# EAGLE design lippa (EAGLE 9.4.0)

## Sheet 1 of 4
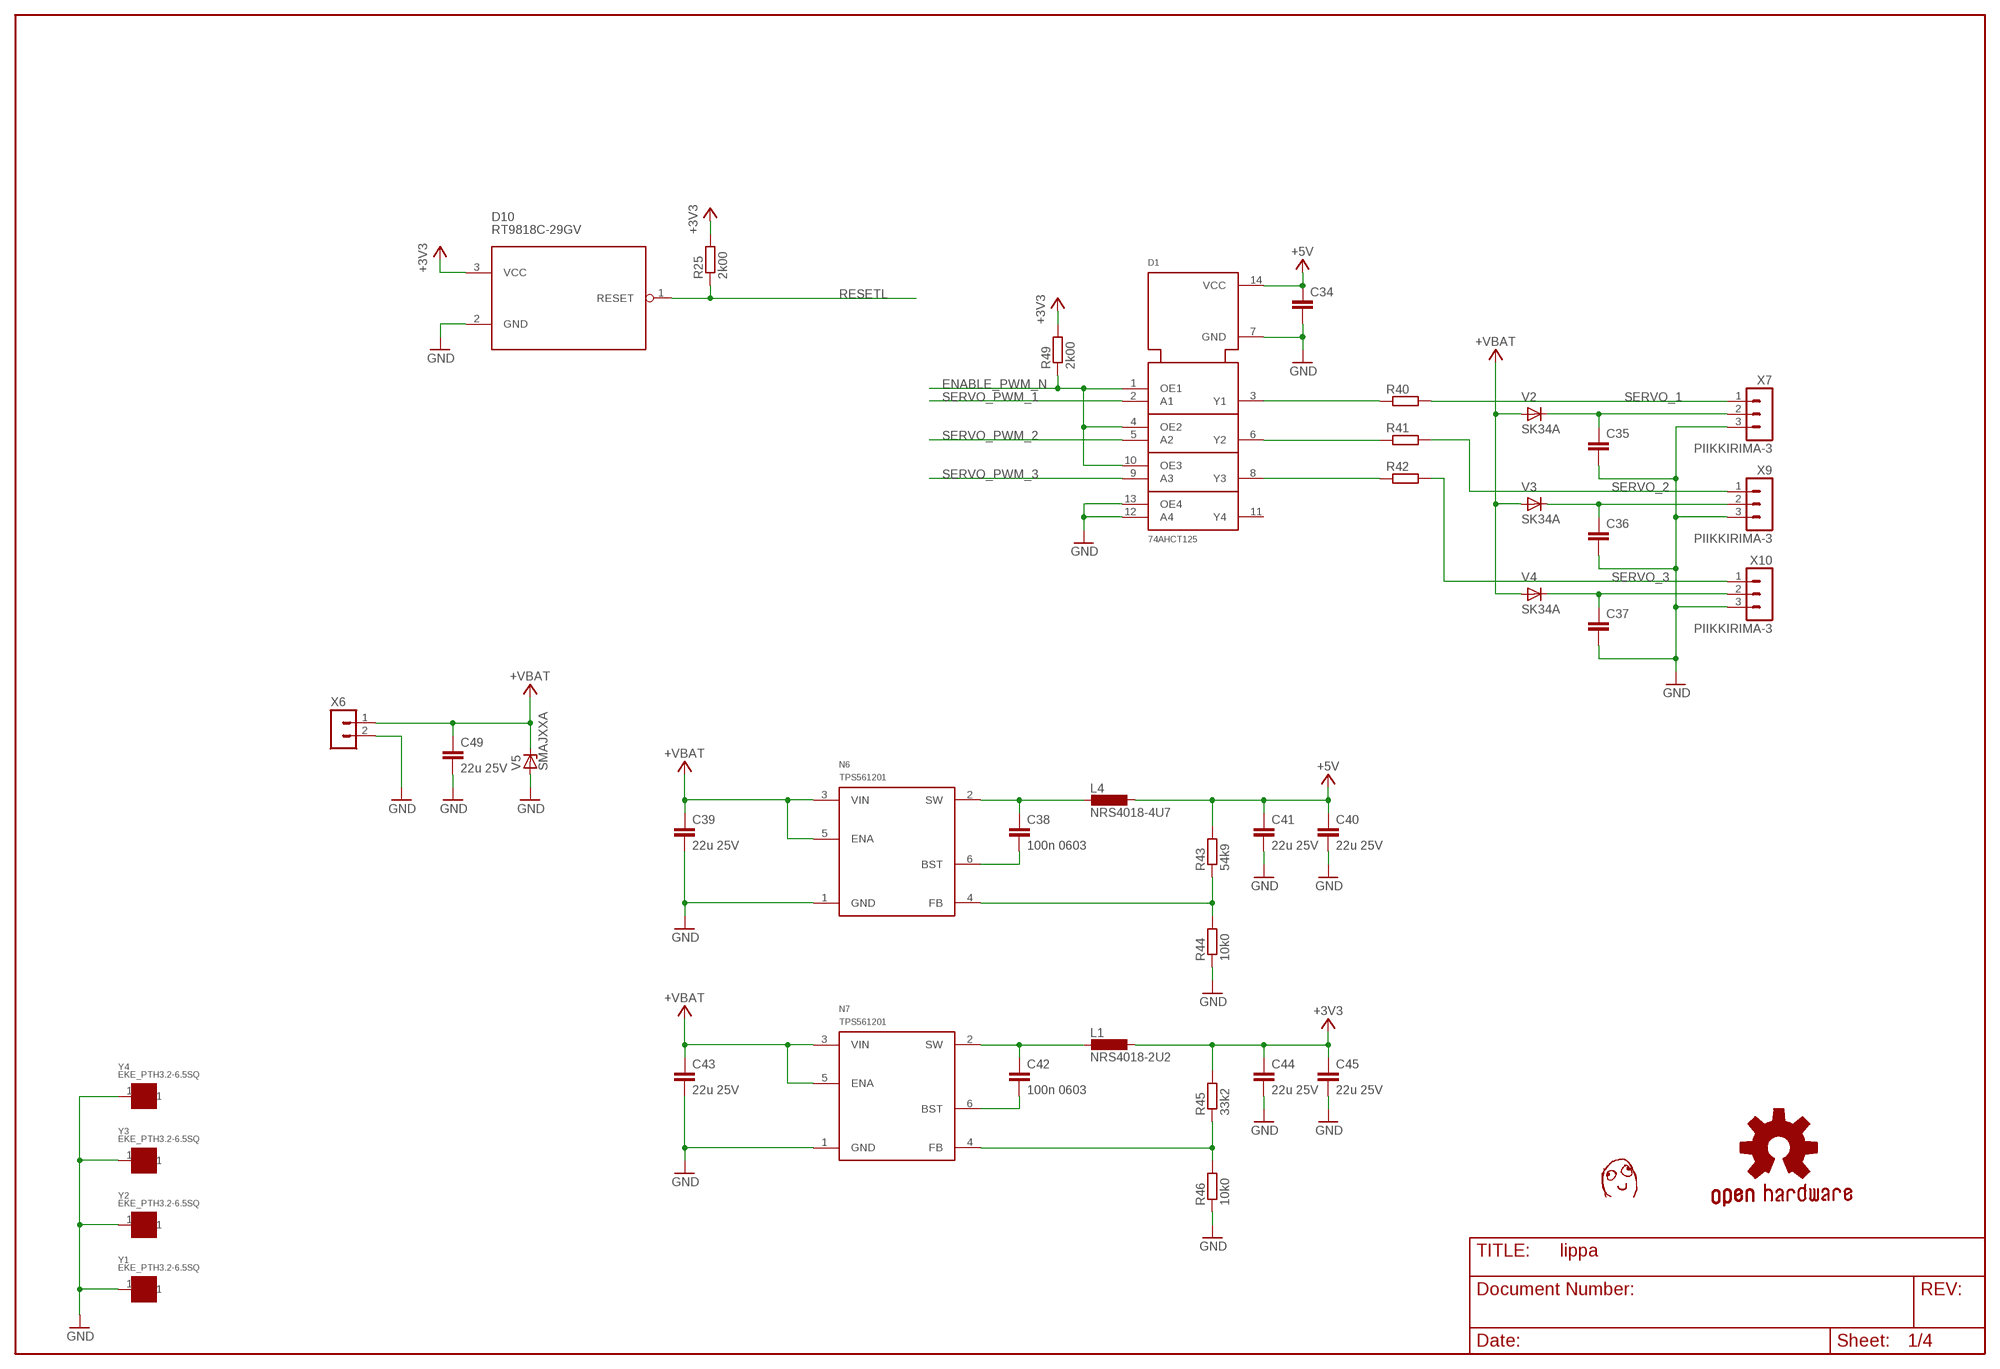
[diagram p0: schematic, sheet 1]

### Parts
C34  OMAT_IC_2_CAP0603  [OMAT_IC_2_C0603]
C35  OMAT_IC_2_CAP0603  [OMAT_IC_2_C0603]
C36  OMAT_IC_2_CAP0603  [OMAT_IC_2_C0603]
C37  OMAT_IC_2_CAP0603  [OMAT_IC_2_C0603]
C38  100n 0603  OMAT_IC_2_CAP0603  [OMAT_IC_2_C0603]
C39  22u 25V  OMAT_IC_2_CAP0805  [OMAT_IC_2_C0805]
C40  22u 25V  OMAT_IC_2_CAP0805  [OMAT_IC_2_C0805]
C41  22u 25V  OMAT_IC_2_CAP0805  [OMAT_IC_2_C0805]
C42  100n 0603  OMAT_IC_2_CAP0603  [OMAT_IC_2_C0603]
C43  22u 25V  OMAT_IC_2_CAP0805  [OMAT_IC_2_C0805]
C44  22u 25V  OMAT_IC_2_CAP0805  [OMAT_IC_2_C0805]
C45  22u 25V  OMAT_IC_2_CAP0805  [OMAT_IC_2_C0805]
C49  22u 25V  OMAT_IC_2_CAP0805  [OMAT_IC_2_C0805]
D1  74AHCT125  [SO14]
D10  RT9818C-29GV  [SOT23]
L1  NRS4018-2U2  [NRS4018]
L4  NRS4018-4U7  [NRS4018]
N6  TPS561201  [OMAT_IC_2_SOT23-6]
N7  TPS561201  [OMAT_IC_2_SOT23-6]
R25  2k00  RES0603  [R0603]
R40  OMAT_IC_2_RES0603  [OMAT_IC_2_R0603]
R41  OMAT_IC_2_RES0603  [OMAT_IC_2_R0603]
R42  OMAT_IC_2_RES0603  [OMAT_IC_2_R0603]
R43  54k9  OMAT_IC_2_RES0603  [OMAT_IC_2_R0603]
R44  10k0  OMAT_IC_2_RES0603  [OMAT_IC_2_R0603]
R45  33k2  OMAT_IC_2_RES0603  [OMAT_IC_2_R0603]
R46  10k0  OMAT_IC_2_RES0603  [OMAT_IC_2_R0603]
R49  2k00  RES0603  [R0603]
U$1  DAFUG  [DAFUG]
V2  SK34A  [OMAT_IC_2_DO214AC]
V3  SK34A  [OMAT_IC_2_DO214AC]
V4  SK34A  [OMAT_IC_2_DO214AC]
V5  SMAJXXA  [DO214AC]
X6  TE_RUUVILIITIN2  [TE_RUUVILIITIN2]
X7  PIIKKIRIMA-3  [PIIKKIRIMA-3]
X9  PIIKKIRIMA-3  [PIIKKIRIMA-3]
X10  PIIKKIRIMA-3  [PIIKKIRIMA-3]
Y1  EKE_PTH3.2-6.5SQ  [EKE_PTH-3.2-6.5SQ]
Y2  EKE_PTH3.2-6.5SQ  [EKE_PTH-3.2-6.5SQ]
Y3  EKE_PTH3.2-6.5SQ  [EKE_PTH-3.2-6.5SQ]
Y4  EKE_PTH3.2-6.5SQ  [EKE_PTH-3.2-6.5SQ]

### Nets
+3V3: C44.1 C45.1 D10.3(VCC) L1.1 R25.2 R45.2 R49.2 ; also sheet 2,3,4
+5V: C34.1 C40.1 C41.1 D1.14(VCC) L4.1 R43.2 ; also sheet 4
+VBAT [other]: C39.1 C43.1 C49.1 N6.3(VIN) N6.5(ENA) N7.3(VIN) N7.5(ENA) V2.A V3.A V4.A V5.C X6.1 ; also sheet 2,3
ENABLE_PWM_N: D1.1(OE1) D1.4(OE2) D1.10(OE3) R49.1 ; also sheet 4
GND: C34.2 C35.2 C36.2 C37.2 C39.2 C40.2 C41.2 C43.2 C44.2 C45.2 C49.2 D1.7(GND) D1.12(A4) D1.13(OE4) D10.2(GND) N6.1(GND) N7.1(GND) R44.1 R46.1 V5.A X6.2 X7.3 X9.3 X10.3 Y1.1 Y2.1 Y3.1 Y4.1 ; also sheet 2,3,4
N$28: D1.3(Y1) R40.1
N$29: D1.6(Y2) R41.1
N$30: D1.8(Y3) R42.1
N$43: C38.1 L4.2 N6.2(SW)
N$44: C37.1 V4.C X10.2
N$45: C36.1 V3.C X9.2
N$58: C35.1 V2.C X7.2
N$59: C38.2 N6.6(BST)
N$60: N6.4(FB) R43.1 R44.2
N$74: C42.1 L1.2 N7.2(SW)
N$75: C42.2 N7.6(BST)
N$76: N7.4(FB) R45.1 R46.2
RESETL: D10.1(RESET) R25.1 ; also sheet 3
SERVO_1: R40.2 X7.1
SERVO_2: R41.2 X9.1
SERVO_3: R42.2 X10.1
SERVO_PWM_1: D1.2(A1) ; also sheet 4
SERVO_PWM_2: D1.5(A2) ; also sheet 4
SERVO_PWM_3: D1.9(A3) ; also sheet 4
Unconnected: D1.11(Y4)

## Sheet 2 of 4
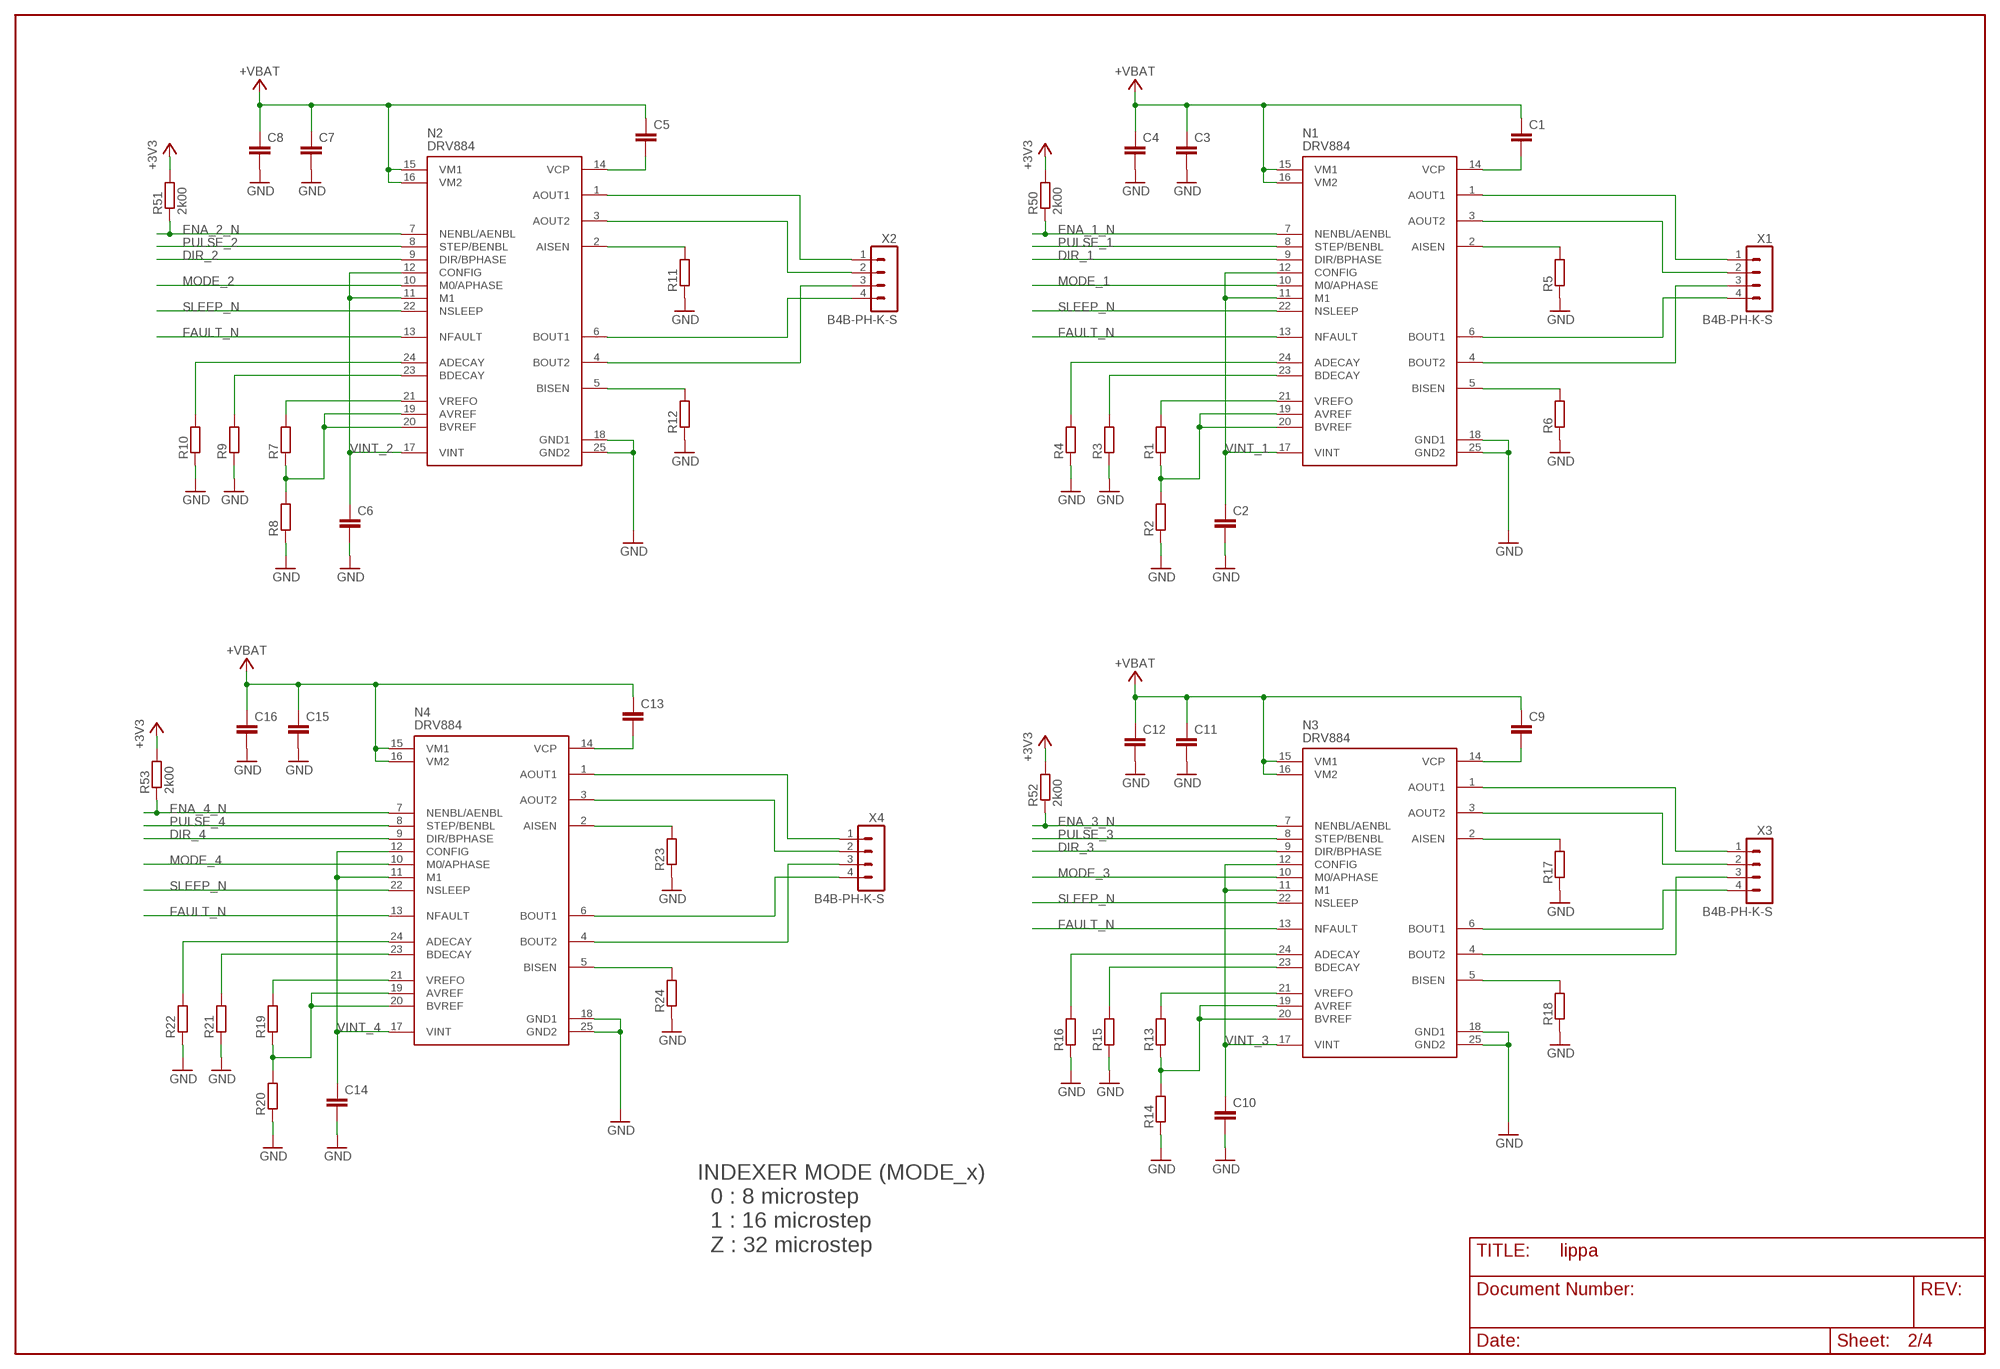
[diagram p1: schematic, sheet 2]

### Parts
C1  OMAT_IC_2_CAP0603  [OMAT_IC_2_C0603]
C2  OMAT_IC_2_CAP0603  [OMAT_IC_2_C0603]
C3  OMAT_IC_2_CAP0603  [OMAT_IC_2_C0603]
C4  OMAT_IC_2_CAP0805  [OMAT_IC_2_C0805]
C5  OMAT_IC_2_CAP0603  [OMAT_IC_2_C0603]
C6  OMAT_IC_2_CAP0603  [OMAT_IC_2_C0603]
C7  OMAT_IC_2_CAP0603  [OMAT_IC_2_C0603]
C8  OMAT_IC_2_CAP0805  [OMAT_IC_2_C0805]
C9  OMAT_IC_2_CAP0603  [OMAT_IC_2_C0603]
C10  OMAT_IC_2_CAP0603  [OMAT_IC_2_C0603]
C11  OMAT_IC_2_CAP0603  [OMAT_IC_2_C0603]
C12  OMAT_IC_2_CAP0805  [OMAT_IC_2_C0805]
C13  OMAT_IC_2_CAP0603  [OMAT_IC_2_C0603]
C14  OMAT_IC_2_CAP0603  [OMAT_IC_2_C0603]
C15  OMAT_IC_2_CAP0603  [OMAT_IC_2_C0603]
C16  OMAT_IC_2_CAP0805  [OMAT_IC_2_C0805]
N1  DRV884  [QFN50P400X400X100-25N]
N2  DRV884  [QFN50P400X400X100-25N]
N3  DRV884  [QFN50P400X400X100-25N]
N4  DRV884  [QFN50P400X400X100-25N]
R1  OMAT_IC_2_RES0603  [OMAT_IC_2_R0603]
R2  OMAT_IC_2_RES0603  [OMAT_IC_2_R0603]
R3  OMAT_IC_2_RES0603  [OMAT_IC_2_R0603]
R4  OMAT_IC_2_RES0603  [OMAT_IC_2_R0603]
R5  OMAT_IC_2_RES1206  [OMAT_IC_2_R1206]
R6  OMAT_IC_2_RES1206  [OMAT_IC_2_R1206]
R7  OMAT_IC_2_RES0603  [OMAT_IC_2_R0603]
R8  OMAT_IC_2_RES0603  [OMAT_IC_2_R0603]
R9  OMAT_IC_2_RES0603  [OMAT_IC_2_R0603]
R10  OMAT_IC_2_RES0603  [OMAT_IC_2_R0603]
R11  OMAT_IC_2_RES1206  [OMAT_IC_2_R1206]
R12  OMAT_IC_2_RES1206  [OMAT_IC_2_R1206]
R13  OMAT_IC_2_RES0603  [OMAT_IC_2_R0603]
R14  OMAT_IC_2_RES0603  [OMAT_IC_2_R0603]
R15  OMAT_IC_2_RES0603  [OMAT_IC_2_R0603]
R16  OMAT_IC_2_RES0603  [OMAT_IC_2_R0603]
R17  OMAT_IC_2_RES1206  [OMAT_IC_2_R1206]
R18  OMAT_IC_2_RES1206  [OMAT_IC_2_R1206]
R19  OMAT_IC_2_RES0603  [OMAT_IC_2_R0603]
R20  OMAT_IC_2_RES0603  [OMAT_IC_2_R0603]
R21  OMAT_IC_2_RES0603  [OMAT_IC_2_R0603]
R22  OMAT_IC_2_RES0603  [OMAT_IC_2_R0603]
R23  OMAT_IC_2_RES1206  [OMAT_IC_2_R1206]
R24  OMAT_IC_2_RES1206  [OMAT_IC_2_R1206]
R50  2k00  RES0603  [R0603]
R51  2k00  RES0603  [R0603]
R52  2k00  RES0603  [R0603]
R53  2k00  RES0603  [R0603]
X1  B4B-PH-K-S  [B4B-PH-K-S]
X2  B4B-PH-K-S  [B4B-PH-K-S]
X3  B4B-PH-K-S  [B4B-PH-K-S]
X4  B4B-PH-K-S  [B4B-PH-K-S]

### Nets
+3V3: R50.2 R51.2 R52.2 R53.2 ; also sheet 1,3,4
+VBAT [other]: C1.1 C3.1 C4.1 C5.1 C7.1 C8.1 C9.1 C11.1 C12.1 C13.1 C15.1 C16.1 N1.15(VM1) N1.16(VM2) N2.15(VM1) N2.16(VM2) N3.15(VM1) N3.16(VM2) N4.15(VM1) N4.16(VM2) ; also sheet 1,3
DIR_1: N1.9(DIR/BPHASE) ; also sheet 4
DIR_2: N2.9(DIR/BPHASE) ; also sheet 4
DIR_3: N3.9(DIR/BPHASE) ; also sheet 4
DIR_4: N4.9(DIR/BPHASE) ; also sheet 4
ENA_1_N: N1.7(NENBL/AENBL) R50.1 ; also sheet 4
ENA_2_N: N2.7(NENBL/AENBL) R51.1 ; also sheet 4
ENA_3_N: N3.7(NENBL/AENBL) R52.1 ; also sheet 4
ENA_4_N: N4.7(NENBL/AENBL) R53.1 ; also sheet 4
FAULT_N: N1.13(NFAULT) N2.13(NFAULT) N3.13(NFAULT) N4.13(NFAULT) ; also sheet 4
GND: C2.2 C3.2 C4.2 C6.2 C7.2 C8.2 C10.2 C11.2 C12.2 C14.2 C15.2 C16.2 N1.18(GND1) N1.25(GND2) N2.18(GND1) N2.25(GND2) N3.18(GND1) N3.25(GND2) N4.18(GND1) N4.25(GND2) R2.1 R3.1 R4.1 R5.1 R6.1 R8.1 R9.1 R10.1 R11.1 R12.1 R14.1 R15.1 R16.1 R17.1 R18.1 R20.1 R21.1 R22.1 R23.1 R24.1 ; also sheet 1,3,4
MODE_1: N1.10(M0/APHASE) ; also sheet 4
MODE_2: N2.10(M0/APHASE) ; also sheet 4
MODE_3: N3.10(M0/APHASE) ; also sheet 4
MODE_4: N4.10(M0/APHASE) ; also sheet 4
N$1: C1.2 N1.14(VCP)
N$3: N1.24(ADECAY) R4.2
N$4: N1.21(VREFO) R1.2
N$5: N1.19(AVREF) N1.20(BVREF) R1.1 R2.2
N$6: N1.23(BDECAY) R3.2
N$7: N1.2(AISEN) R5.2
N$8: N1.5(BISEN) R6.2
N$9: N1.6(BOUT1) X1.4
N$10: N1.4(BOUT2) X1.3
N$11: N1.1(AOUT1) X1.1
N$12: N1.3(AOUT2) X1.2
N$13: C5.2 N2.14(VCP)
N$18: N2.21(VREFO) R7.2
N$19: N2.19(AVREF) N2.20(BVREF) R7.1 R8.2
N$20: N2.24(ADECAY) R10.2
N$21: N2.23(BDECAY) R9.2
N$22: N2.2(AISEN) R11.2
N$23: N2.5(BISEN) R12.2
N$24: N2.6(BOUT1) X2.4
N$25: N2.4(BOUT2) X2.3
N$26: N2.1(AOUT1) X2.1
N$27: N2.3(AOUT2) X2.2
N$31: C9.2 N3.14(VCP)
N$33: N3.21(VREFO) R13.2
N$34: N3.19(AVREF) N3.20(BVREF) R13.1 R14.2
N$35: N3.24(ADECAY) R16.2
N$36: N3.23(BDECAY) R15.2
N$37: N3.2(AISEN) R17.2
N$38: N3.5(BISEN) R18.2
N$39: N3.6(BOUT1) X3.4
N$40: N3.4(BOUT2) X3.3
N$41: N3.1(AOUT1) X3.1
N$42: N3.3(AOUT2) X3.2
N$46: C13.2 N4.14(VCP)
N$48: N4.21(VREFO) R19.2
N$49: N4.19(AVREF) N4.20(BVREF) R19.1 R20.2
N$50: N4.24(ADECAY) R22.2
N$51: N4.23(BDECAY) R21.2
N$52: N4.2(AISEN) R23.2
N$53: N4.5(BISEN) R24.2
N$54: N4.6(BOUT1) X4.4
N$55: N4.4(BOUT2) X4.3
N$56: N4.1(AOUT1) X4.1
N$57: N4.3(AOUT2) X4.2
PULSE_1: N1.8(STEP/BENBL) ; also sheet 4
PULSE_2: N2.8(STEP/BENBL) ; also sheet 4
PULSE_3: N3.8(STEP/BENBL) ; also sheet 4
PULSE_4: N4.8(STEP/BENBL) ; also sheet 4
SLEEP_N: N1.22(NSLEEP) N2.22(NSLEEP) N3.22(NSLEEP) N4.22(NSLEEP) ; also sheet 4
VINT_1: C2.1 N1.11(M1) N1.12(CONFIG) N1.17(VINT)
VINT_2: C6.1 N2.11(M1) N2.12(CONFIG) N2.17(VINT)
VINT_3: C10.1 N3.11(M1) N3.12(CONFIG) N3.17(VINT)
VINT_4: C14.1 N4.11(M1) N4.12(CONFIG) N4.17(VINT)

### Notes on the sheet
- INDEXER MODE (MODE_x)
    0 : 8 microstep
    1 : 16 microstep
    Z : 32 microstep

## Sheet 3 of 4
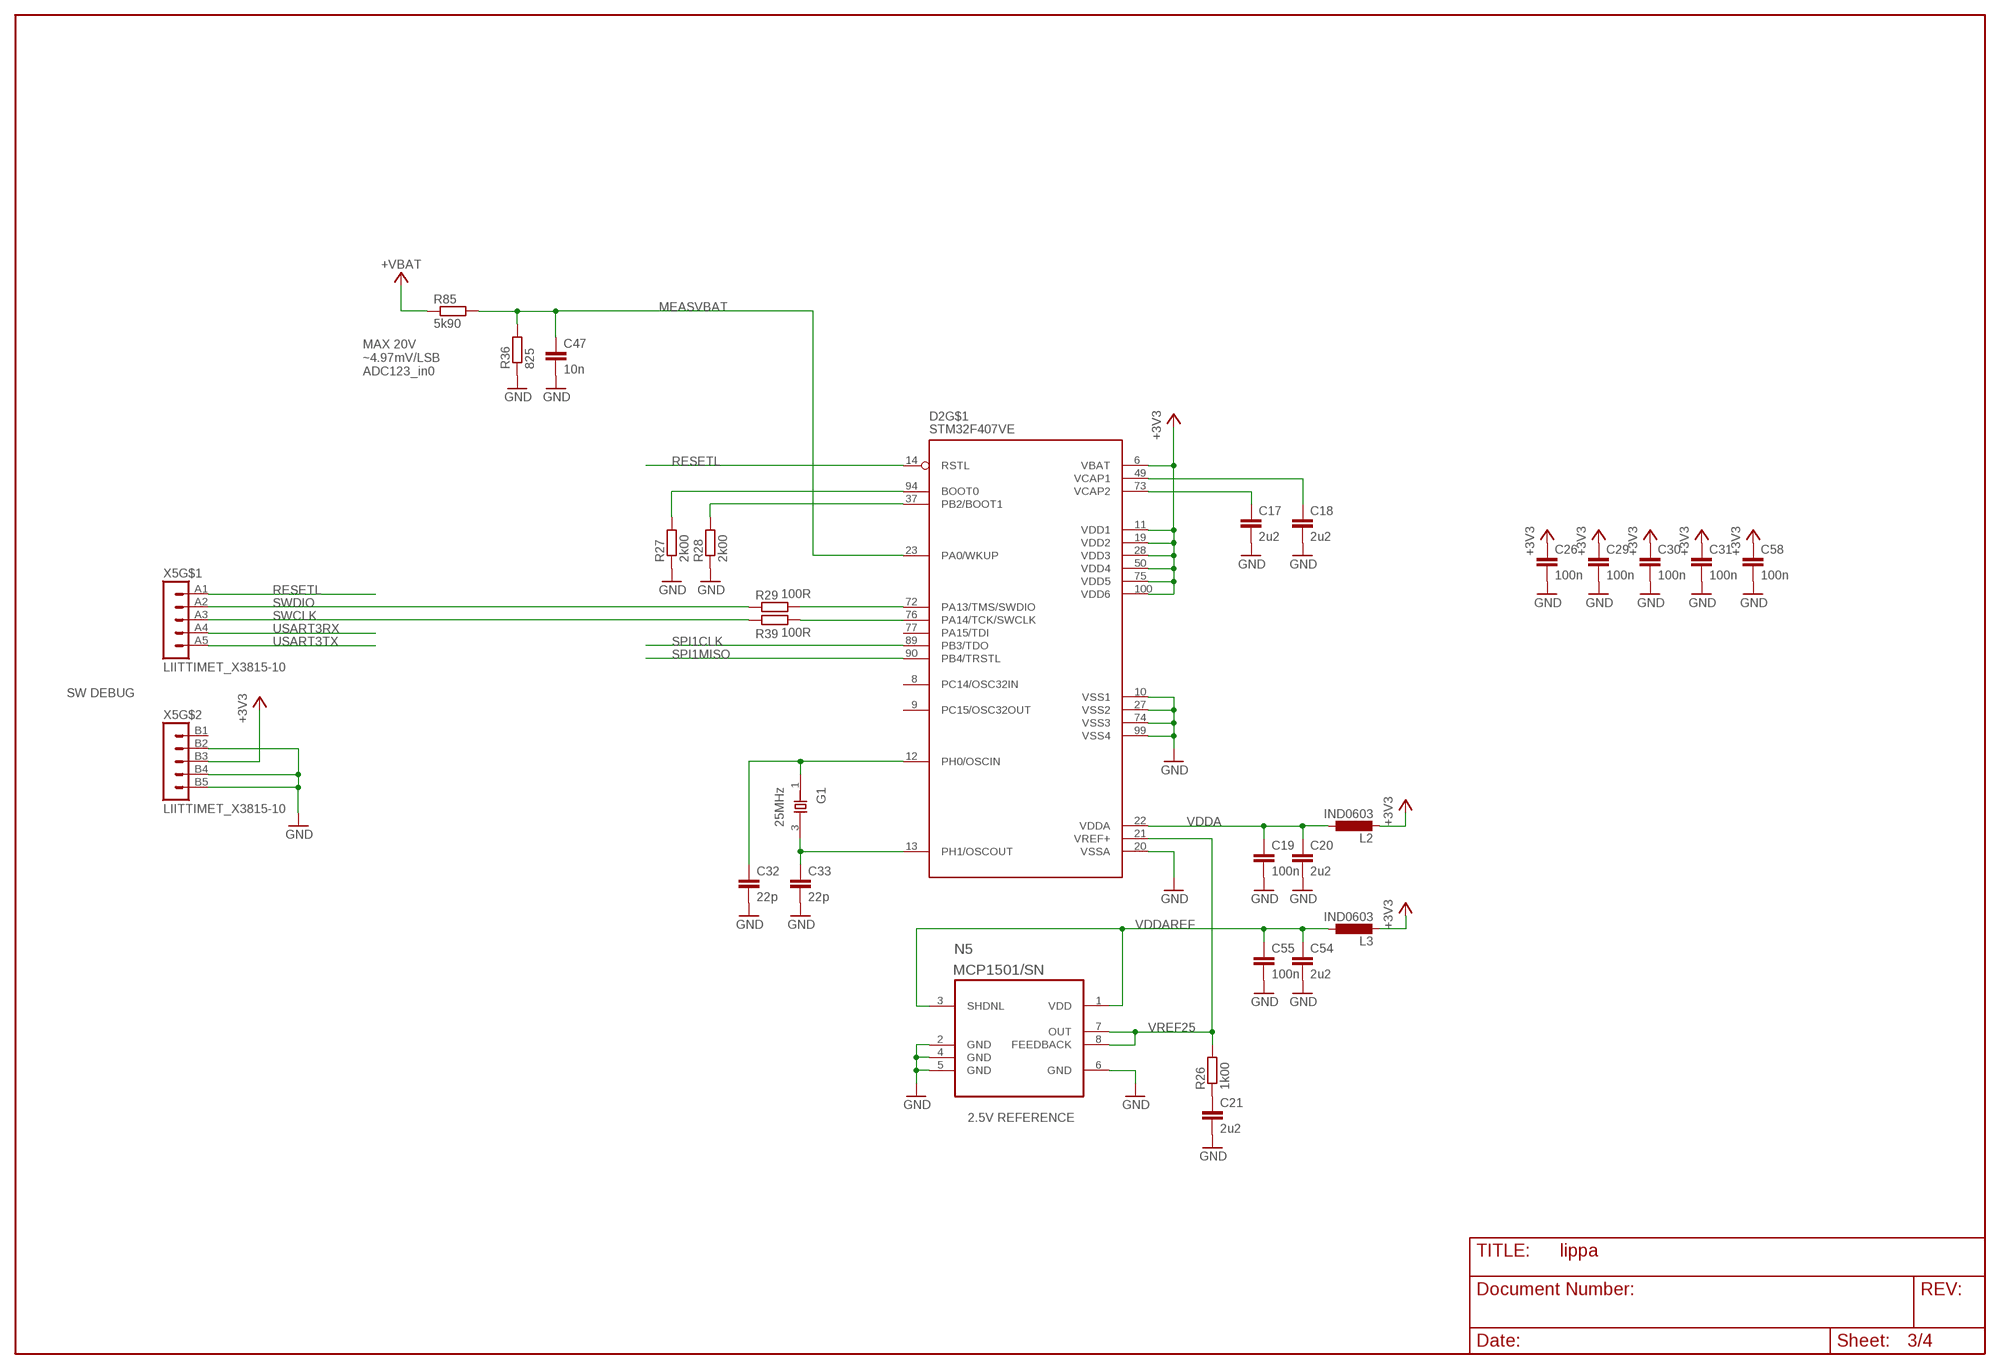
[diagram p2: schematic, sheet 3]

### Parts
C17  2u2  CAP0603  [C0603]
C18  2u2  CAP0603  [C0603]
C19  100n  CAP0603  [C0603]
C20  2u2  CAP0603  [C0603]
C21  2u2  CAP0603  [C0603]
C26  100n  CAP0603  [C0603]
C29  100n  CAP0603  [C0603]
C30  100n  CAP0603  [C0603]
C31  100n  CAP0603  [C0603]
C32  22p  CAP0603  [C0603]
C33  22p  CAP0603  [C0603]
C47  10n  CAP0603  [C0603]
C54  2u2  CAP0603  [C0603]
C55  100n  CAP0603  [C0603]
C58  100n  CAP0603  [C0603]
D2  STM32F407VE  [LQFP-100]
G1  25MHz  XTAL_3225_SMD  [X_3225]
L2  IND0603  [R0603]
L3  IND0603  [R0603]
N5  MCP1501/SN  [SOIC8-N_MC]
R26  1k00  RES0603  [R0603]
R27  2k00  RES0603  [R0603]
R28  2k00  RES0603  [R0603]
R29  100R  PASSIIVIT_RES0603  [PASSIIVIT_R0603]
R36  825  RES0603  [R0603]
R39  100R  PASSIIVIT_RES0603  [PASSIIVIT_R0603]
R85  5k90  RES0603  [R0603]
X5  LIITTIMET_X3815-10  [LIITTIMET_15110102601]

### Nets
+3V3: C26.1 C29.1 C30.1 C31.1 C58.1 D2.6(VBAT) D2.11(VDD1) D2.19(VDD2) D2.28(VDD3) D2.50(VDD4) D2.75(VDD5) D2.100(VDD6) L2.2 L3.2 X5.B3 ; also sheet 1,2,4
+VBAT [other]: R85.1 ; also sheet 1,2
BOOT0: D2.94(BOOT0) R27.2
BOOT1: D2.37(PB2/BOOT1) R28.2
GND: C17.2 C18.2 C19.2 C20.2 C21.2 C26.2 C29.2 C30.2 C31.2 C32.2 C33.2 C47.2 C54.2 C55.2 C58.2 D2.10(VSS1) D2.20(VSSA) D2.27(VSS2) D2.74(VSS3) D2.99(VSS4) N5.2(GND) N5.4(GND) N5.5(GND) N5.6(GND) R27.1 R28.1 R36.1 X5.B2 X5.B4 X5.B5 ; also sheet 1,2,4
MEASVBAT: C47.1 D2.23(PA0/WKUP) R36.2 R85.2
N$61: C21.1 R26.1
OSCIN: C32.1 D2.12(PH0/OSCIN) G1.1(X1)
OSCOUT: C33.1 D2.13(PH1/OSCOUT) G1.3(X2)
RESETL: D2.14(RSTL) X5.A1 ; also sheet 1
SPI1CLK: D2.89(PB3/TDO) ; also sheet 4
SPI1MISO: D2.90(PB4/TRSTL) ; also sheet 4
SWCLK: R39.1 X5.A3
SWCLK_CPU: D2.76(PA14/TCK/SWCLK) R39.2
SWDIO: R29.1 X5.A2
SWDIO_CPU: D2.72(PA13/TMS/SWDIO) R29.2
USART3RX: X5.A4 ; also sheet 4
USART3TX: X5.A5 ; also sheet 4
VCAP1: C18.1 D2.49(VCAP1)
VCAP2: C17.1 D2.73(VCAP2)
VDDA: C19.1 C20.1 D2.22(VDDA) L2.1
VDDAREF: C54.1 C55.1 L3.1 N5.1(VDD) N5.3(SHDNL)
VREF25: D2.21(VREF+) N5.7(OUT) N5.8(FEEDBACK) R26.2
Unconnected: D2.8(PC14/OSC32IN) D2.9(PC15/OSC32OUT) D2.77(PA15/TDI) X5.B1

### Notes on the sheet
- MAX 20V
  ~4.97mV/LSB
  ADC123_in0
- SW DEBUG
- 2.5V REFERENCE

## Sheet 4 of 4
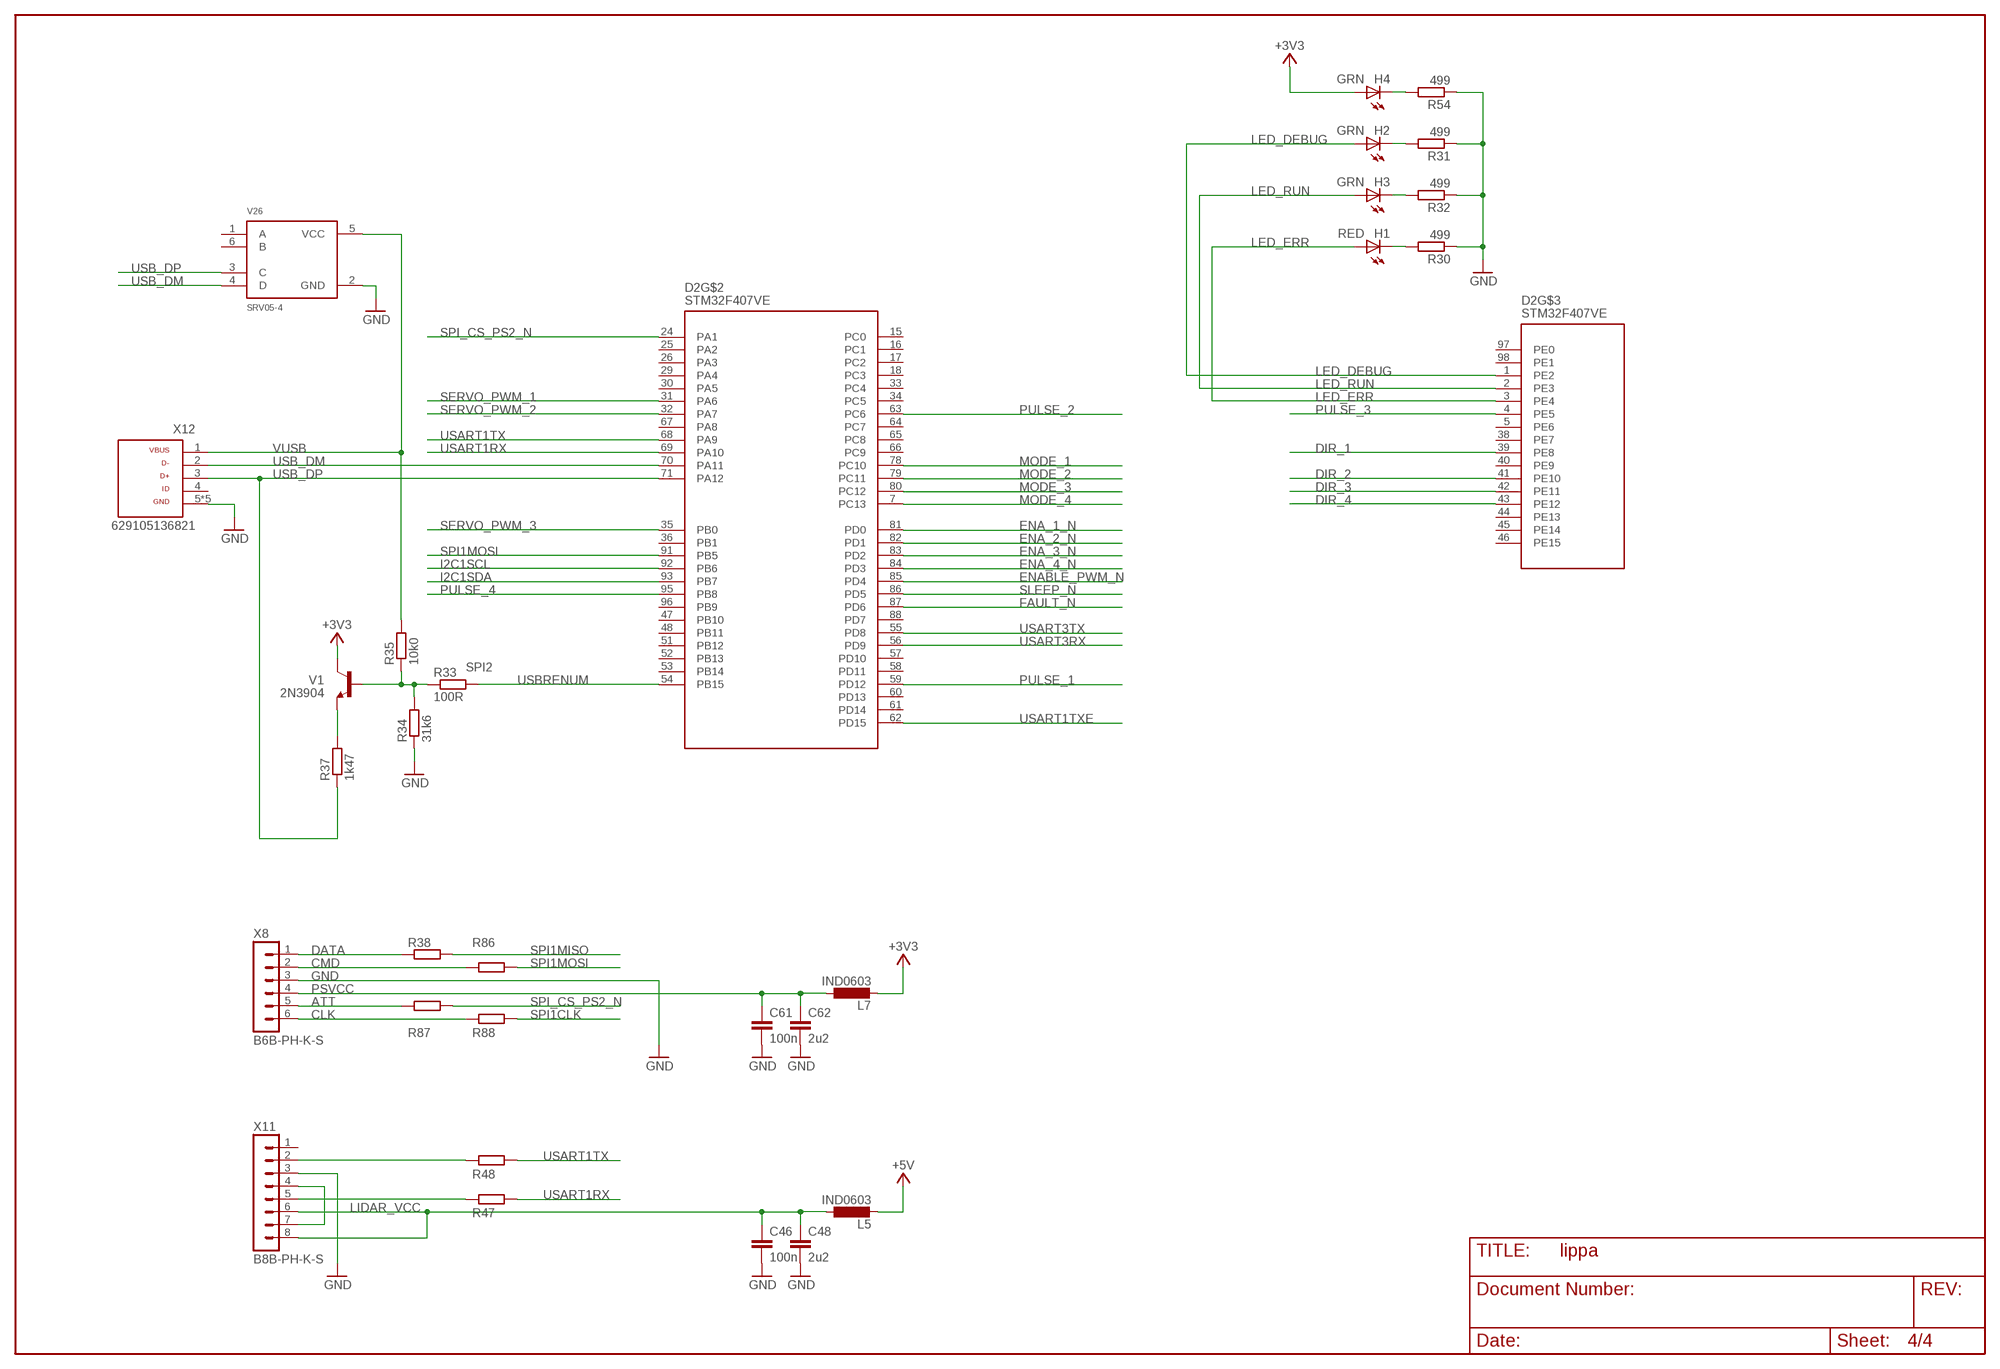
[diagram p3: schematic, sheet 4]

### Parts
C46  100n  CAP0603  [C0603]
C48  2u2  CAP0603  [C0603]
C61  100n  CAP0603  [C0603]
C62  2u2  CAP0603  [C0603]
H1  RED  LEDCHIP-LED0603  [CHIP-LED0603]
H2  GRN  LEDCHIP-LED0603  [CHIP-LED0603]
H3  GRN  LEDCHIP-LED0603  [CHIP-LED0603]
H4  GRN  LEDCHIP-LED0603  [CHIP-LED0603]
L5  IND0603  [R0603]
L7  IND0603  [R0603]
R30  499  RES0603  [R0603]
R31  499  RES0603  [R0603]
R32  499  RES0603  [R0603]
R33  100R  PASSIIVIT_RES0603  [PASSIIVIT_R0603]
R34  31k6  PASSIIVIT_RES0603  [PASSIIVIT_R0603]
R35  10k0  PASSIIVIT_RES0603  [PASSIIVIT_R0603]
R37  1k47  PASSIIVIT_RES0603  [PASSIIVIT_R0603]
R38  RES0603  [OMAT_IC_2_R0603]
R47  RES0603  [OMAT_IC_2_R0603]
R48  RES0603  [OMAT_IC_2_R0603]
R54  499  RES0603  [R0603]
R86  RES0603  [OMAT_IC_2_R0603]
R87  RES0603  [OMAT_IC_2_R0603]
R88  RES0603  [OMAT_IC_2_R0603]
V1  2N3904  [OMAT_IC_2_SOT23]
V26  SRV05-4  [OMAT_IC_2_SOT23-6]
X8  B6B-PH-K-S  [B6B-PH-K-S]
X11  B8B-PH-K-S  [B8B-PH-K-S]
X12  629105136821  [629105136821]

### Nets
+3V3: H4.A L7.2 V1.3(C) ; also sheet 1,2,3
+5V: L5.2 ; also sheet 1
ATT: R87.1 X8.5
CLK: R88.1 X8.6
CMD: R86.1 X8.2
DATA: R38.1 X8.1
DIR_1: D2.39(PE8) ; also sheet 2
DIR_2: D2.41(PE10) ; also sheet 2
DIR_3: D2.42(PE11) ; also sheet 2
DIR_4: D2.43(PE12) ; also sheet 2
ENA_1_N: D2.81(PD0) ; also sheet 2
ENA_2_N: D2.82(PD1) ; also sheet 2
ENA_3_N: D2.83(PD2) ; also sheet 2
ENA_4_N: D2.84(PD3) ; also sheet 2
ENABLE_PWM_N: D2.85(PD4) ; also sheet 1
FAULT_N: D2.87(PD6) ; also sheet 2
GND: C46.2 C48.2 C61.2 C62.2 R30.1 R31.1 R32.1 R34.1 R54.1 V26.2(GND) X8.3 X11.3 X12.5 X12.Z1 X12.Z2 X12.Z3 X12.Z4 ; also sheet 1,2,3
I2C1SCL: D2.92(PB6)
I2C1SDA: D2.93(PB7)
LED_DEBUG: D2.1(PE2) H2.A
LED_ERR: D2.3(PE4) H1.A
LED_RUN: D2.2(PE3) H3.A
LIDAR_VCC: C46.1 C48.1 L5.1 X11.6 X11.8
MODE_1: D2.78(PC10) ; also sheet 2
MODE_2: D2.79(PC11) ; also sheet 2
MODE_3: D2.80(PC12) ; also sheet 2
MODE_4: D2.7(PC13) ; also sheet 2
N$17: H4.C R54.2
N$64: H2.C R31.2
N$65: H1.C R30.2
N$66: H3.C R32.2
N$67: R33.1 R34.2 R35.1 V1.1(B)
N$68: R37.2 V1.2(E)
N$69: X11.4 X11.7
N$71: R48.1 X11.2
N$72: R47.1 X11.5
PSVCC: C61.1 C62.1 L7.1 X8.4
PULSE_1: D2.59(PD12) ; also sheet 2
PULSE_2: D2.63(PC6) ; also sheet 2
PULSE_3: D2.4(PE5) ; also sheet 2
PULSE_4: D2.95(PB8) ; also sheet 2
SERVO_PWM_1: D2.31(PA6) ; also sheet 1
SERVO_PWM_2: D2.32(PA7) ; also sheet 1
SERVO_PWM_3: D2.35(PB0) ; also sheet 1
SLEEP_N: D2.86(PD5) ; also sheet 2
SPI1CLK: R88.2 ; also sheet 3
SPI1MISO: R38.2 ; also sheet 3
SPI1MOSI: D2.91(PB5) R86.2
SPI_CS_PS2_N: D2.24(PA1) R87.2
USART1RX: D2.69(PA10) R47.2
USART1TX: D2.68(PA9) R48.2
USART1TXE: D2.62(PD15)
USART3RX: D2.56(PD9) ; also sheet 3
USART3TX: D2.55(PD8) ; also sheet 3
USB_DM [other]: D2.70(PA11) V26.4(D) X12.2
USB_DP [other]: D2.71(PA12) R37.1 V26.3(C) X12.3
USBRENUM: D2.54(PB15) R33.2
VUSB: R35.2 V26.5(VCC) X12.1
Unconnected: D2.5(PE6) D2.15(PC0) D2.16(PC1) D2.17(PC2) D2.18(PC3) D2.25(PA2) D2.26(PA3) D2.29(PA4) D2.30(PA5) D2.33(PC4) D2.34(PC5) D2.36(PB1) D2.38(PE7) D2.40(PE9) D2.44(PE13) D2.45(PE14) D2.46(PE15) D2.47(PB10) D2.48(PB11) D2.51(PB12) D2.52(PB13) D2.53(PB14) D2.57(PD10) D2.58(PD11) D2.60(PD13) D2.61(PD14) D2.64(PC7) D2.65(PC8) D2.66(PC9) D2.67(PA8) D2.88(PD7) D2.96(PB9) D2.97(PE0) D2.98(PE1) V26.1(A) V26.6(B) X11.1 X12.4

### Notes on the sheet
- SPI2

## Library data of the parts
C1-C16 C34-C45 C49 = lippa:OMAT_IC_2_CAP
C17-C21 C26 C29-C33 C46-C48 C54 C55 C58 C61 C62 = omat_ic_2:CAP
D1 = lippa:74AHCT125
D2 = lippa:STM32F407VE
D10 = omat_ic_2:RT9818C-29GV
G1 = omat_ic_2:XTAL_3225_SMD: CRYSTAL CLOCK OSCILLATORS 5.0 Vdc or 3.3 Vdc - LOW PROFILE ULTRA MINIATURE CERAMIC SURFACE MOUNT Source: http://www.abracon.com/Oscillators/asf1-L-L1.pdf
H1-H4 = omat_ic_2:LED: LED OSRAM: - CHIPLED LG R971, LG N971, LY N971, LG Q971, LY Q971, LO R971, LY R971 LH N974, LH R974 LS Q976, LO Q976, LY Q976 LO Q996 - Hyper CHIPLED LW Q18S LB Q993, LB Q99A, LB R99A - SideLED LS A670, LO A670, LY A670, LG A670, LP A670 LB A673, LV A673, LT A673, LW A673 LH A674 LY A675 LS A676, LA A676, LO A676, LY A676, LW A676 LS A679, LY A679, LG A679 - Hyper Micro SIDELED® LS Y876, LA Y876, LO Y876, LY Y876 LT Y87S - SmartLED LW L88C, LW L88S LB L89C, LB L89S, LG L890 LS L89K, LO L89K, LY L89K LS L896, LA L896, LO L896, LY L896 - TOPLED LS T670, LO T670, LY T670, LG T670, LP T670 LSG T670, LSP T670, LSY T670, LOP T670, LYG T670 LG T671, LOG T671, LSG T671 LB T673, LV T673, LT T673, LW T673 LH T674 LS T676, LA T676, LO T676, LY T676, LB T676, LH T676, LSB T676, LW T676 LB T67C, LV T67C, LT T67C, LS T67K, LO T67K, LY T67K, LW E67C LS E67B, LA E67B, LO E67B, LY E67B, LB E67C, LV E67C, LT E67C LW T67C LS T679, LY T679, LG T679 LS T770, LO T770, LY T770, LG T770, LP T770 LB T773, LV T773, LT T773, LW T773 LH T774 LS E675, LA E675, LY E675, LS T675 LS T776, LA T776, LO T776, LY T776, LB T776 LHGB T686 LT T68C, LB T68C - Hyper Mini TOPLED® LB M676 - Mini TOPLED Santana® LG M470 LS M47K, LO M47K, LY M47K Source: http://www.osram.convergy.de LUXEON: - LUMILED® LXK2-PW12-R00, LXK2-PW12-S00, LXK2-PW14-U00, LXK2-PW14-V00 LXK2-PM12-R00, LXK2-PM12-S00, LXK2-PM14-U00 LXK2-PE12-Q00, LXK2-PE12-R00, LXK2-PE12-S00, LXK2-PE14-T00, LXK2-PE14-U00 LXK2-PB12-K00, LXK2-PB12-L00, LXK2-PB12-M00, LXK2-PB14-N00, LXK2-PB14-P00, LXK2-PB14-Q00 LXK2-PR12-L00, LXK2-PR12-M00, LXK2-PR14-Q00, LXK2-PR14-R00 LXK2-PD12-Q00, LXK2-PD12-R00, LXK2-PD12-S00 LXK2-PH12-R00, LXK2-PH12-S00 LXK2-PL12-P00, LXK2-PL12-Q00, LXK2-PL12-R00 Source: www.luxeon.com KINGBRIGHT: KA-3528ASYC Source: www.kingbright.com
L1 L4 = lippa:NRS4018
L2 L3 L5 L7 = omat_ic_2:IND
N1-N4 = lippa:DRV884
N5 = omat_ic_2:MCP1501/SN
N6 N7 = lippa:TPS561201
R1-R24 R40-R46 = lippa:OMAT_IC_2_RES
R25-R28 R30-R32 R36 R49-R54 R85 = omat_ic_2:RES
R29 R33-R35 R37 R39 = aux-io:PASSIIVIT_RES
R38 R47 R48 R86-R88 = cpu:RES
U$1 = lippa:DAFUG
V1 = cpu:2N3904
V2-V4 = lippa:SK34A
V5 = lippa:SMAJXXA
V26 = cpu:SRV05-4
X1-X4 = lippa:B4B-PH-K-S
X5 = aux-io:LIITTIMET_X3815-10
X6 = lippa:TE_RUUVILIITIN2
X7 X9 X10 = lippa:PIIKKIRIMA-3
X8 = lippa:B6B-PH-K-S
X11 = lippa:B8B-PH-K-S
X12 = cpu:629105136821: WR-COM SMT Horizontal 5 Contacts Micro USB Type B,5 pins
Y1-Y4 = lippa:EKE_PTH

## Net classes
2 other: width 0.23 mm, drill 0.3 mm, clearance 0.15 mm

## Board
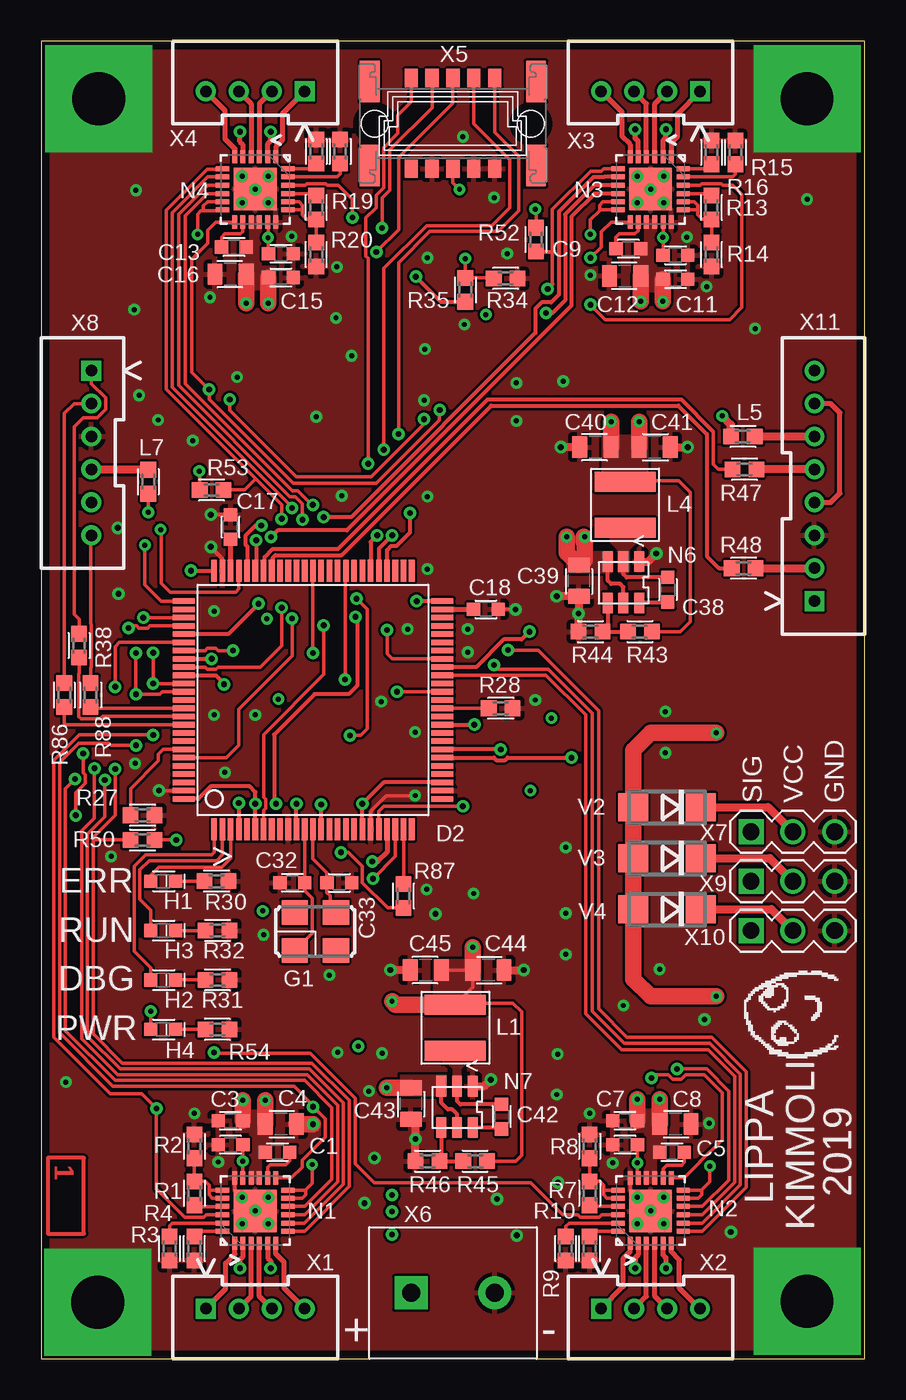
[diagram p4: board, top side]
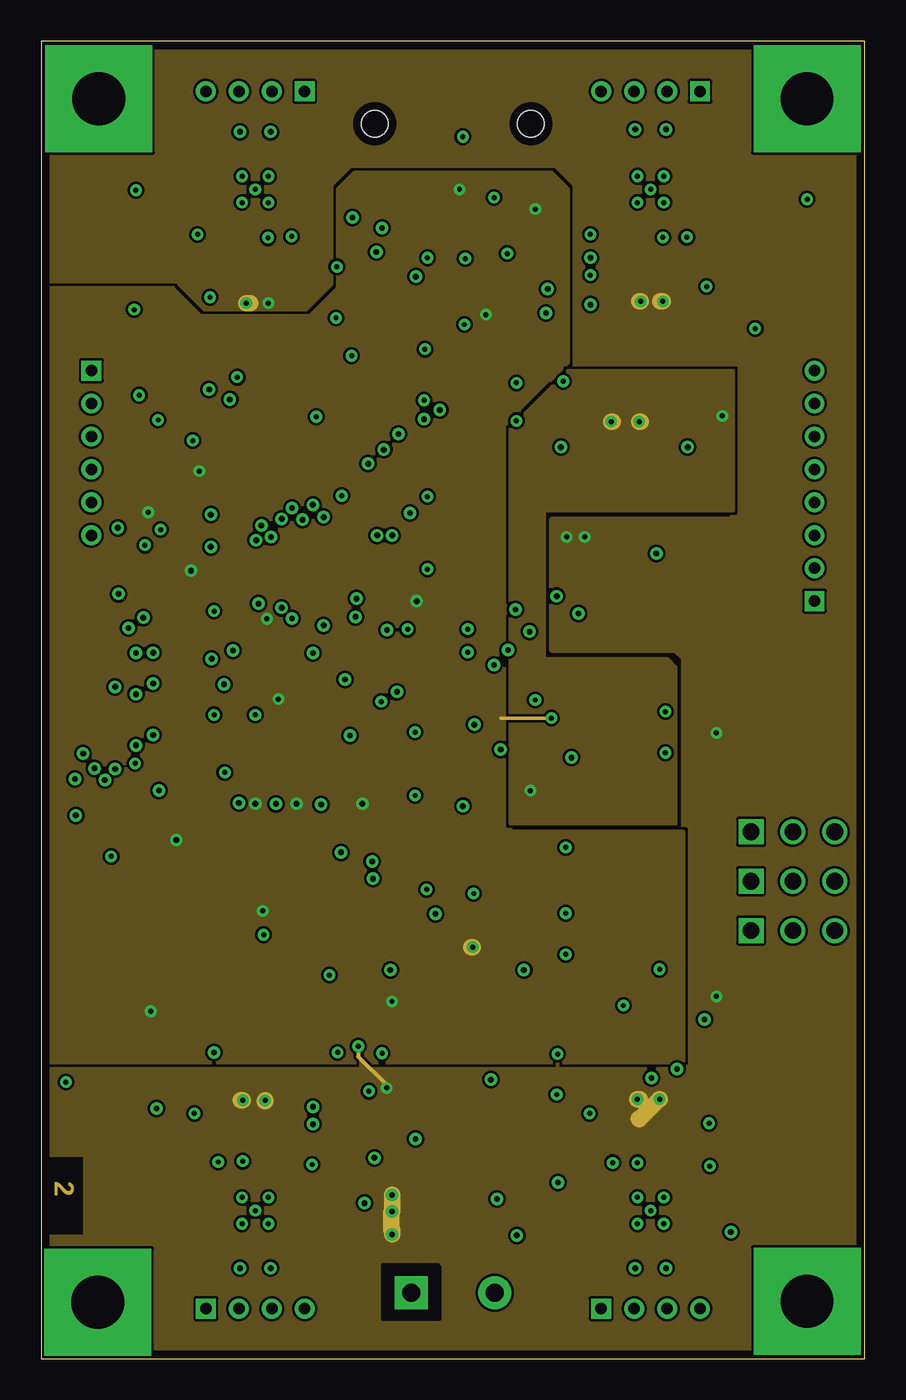
[diagram p5: board, inner layer Route2]
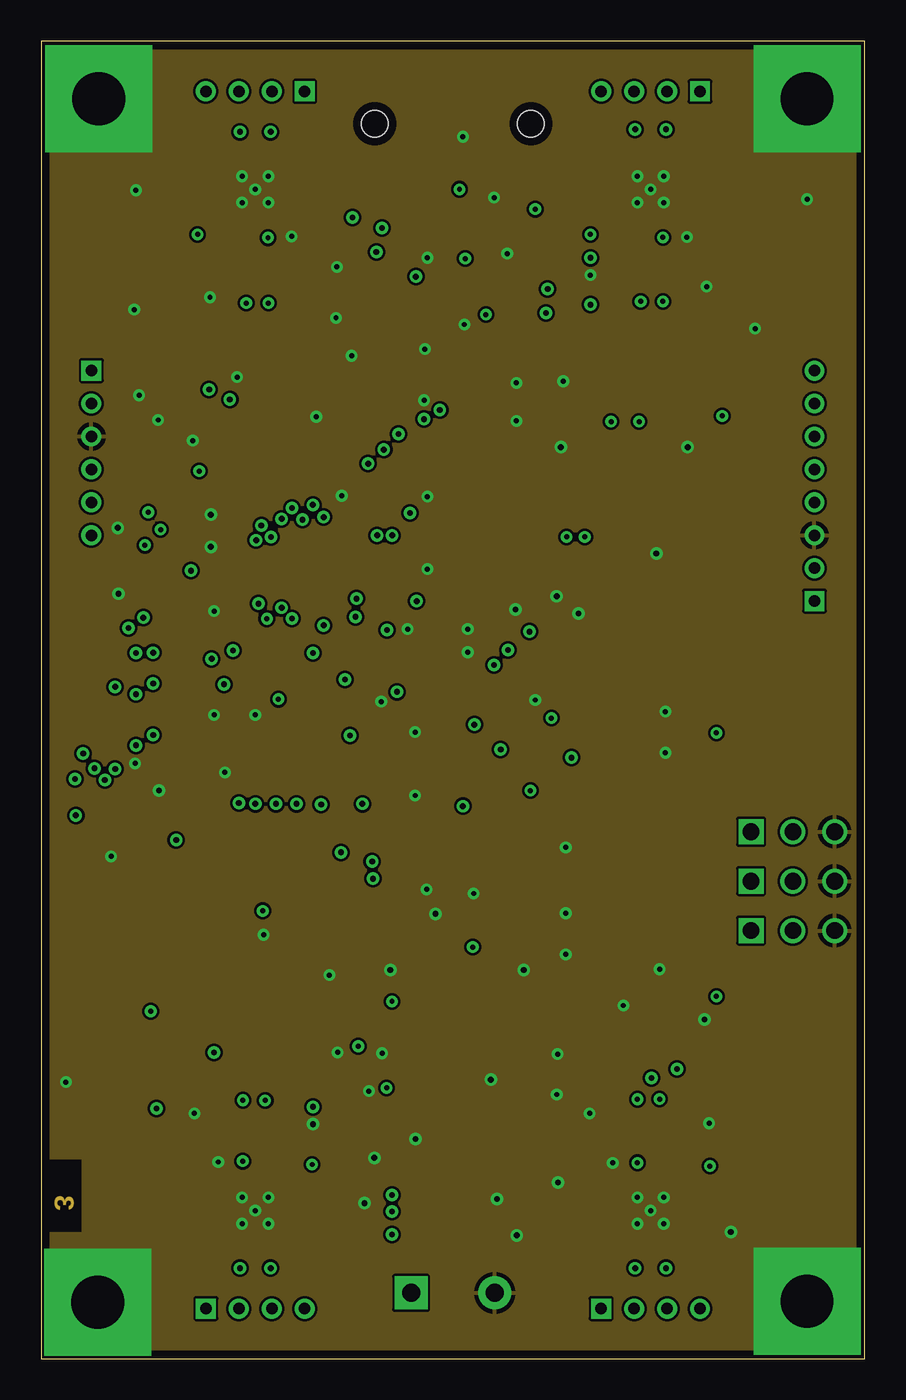
[diagram p6: board, inner layer Route15]
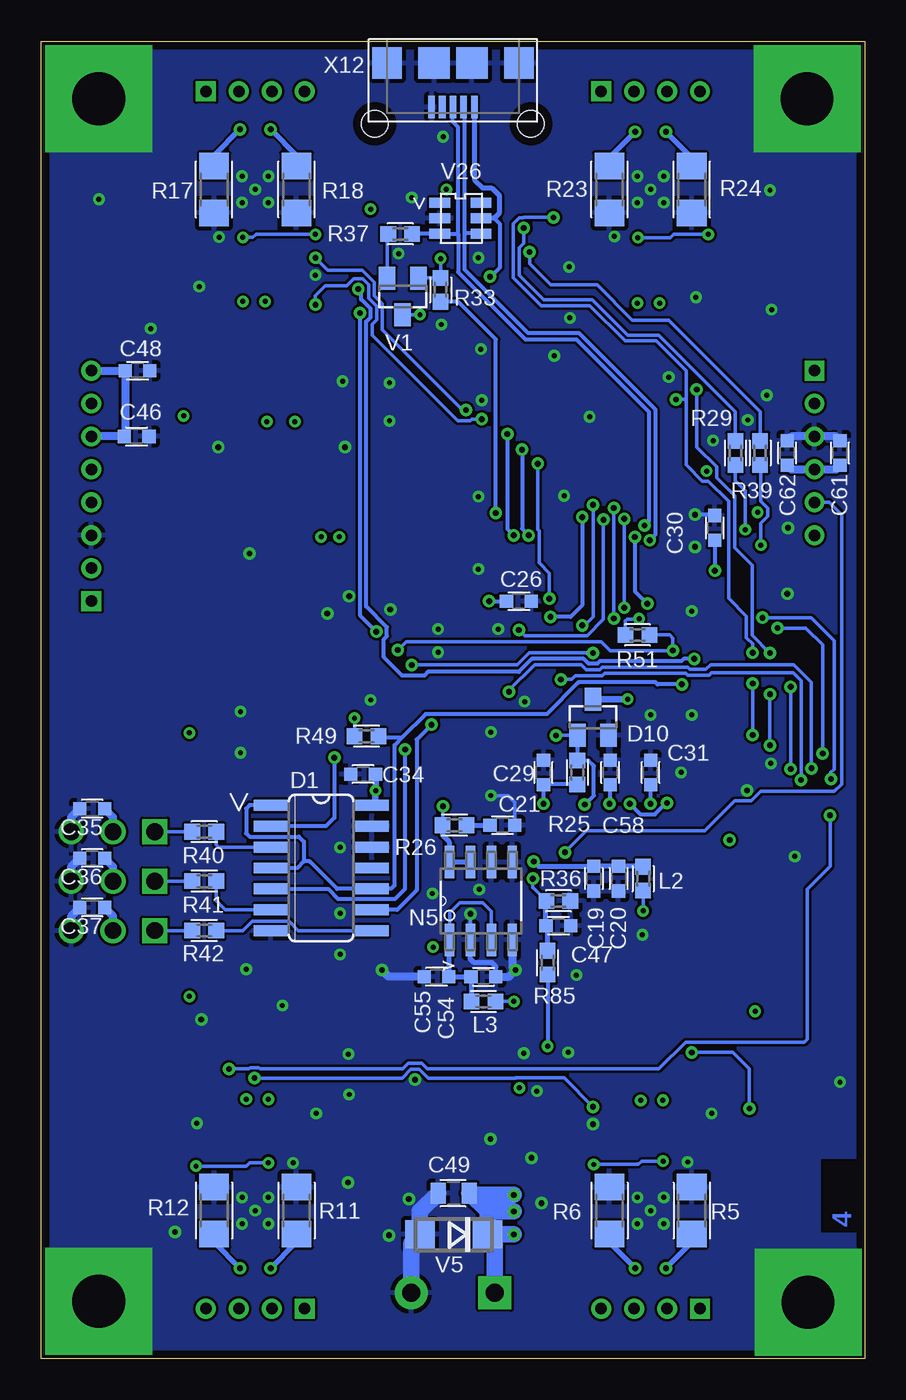
[diagram p7: board, bottom side, seen from below]

Size 50 x 80 mm. Coordinates in mm from the lower left corner, seen from the top.
Outline: 0,0 50,0 50,80 0,80 0,0
Copper layers (1+2*15+16): Top 0.035mm / dielectric 0.11mm / Route2 0.035mm / dielectric 1.13mm / Route15 0.035mm / dielectric 0.11mm / Bottom 0.035mm
Design rules "default *": minimum track width 0.2mm, minimum drill 0.3mm, track to track 6mil, track to pad 6mil, pad to pad 6mil, via to via 6mil, smd to smd 6mil, copper to edge 0.5mm, drill to drill 6mil, minimum pad ring 10mil, minimum via ring 8mil, stop-mask expansion 4mil, vias tented up to drill 0mil, thermal gap 10mil

### Footprints (pad centres in the part's own frame; a part is rotated, then mirrored left to right if it is on the bottom)
OMAT_IC_2_C0603 = smd 0.8 x 0.8: 1 -0.75,0; 2 0.75,0
OMAT_IC_2_C0805 = smd 0.9 x 1.3: 1 -0.95,0; 2 0.95,0
C0603 = smd 0.8 x 0.8: 1 -0.75,0; 2 0.75,0
SO14 = smd 0.66 x 2.032: 1 -3.81,-3.073; 2 -2.54,-3.073; 3 -1.27,-3.073; 4 0,-3.073; 5 1.27,-3.073; 6 2.54,-3.073; 7 3.81,-3.073; 8 3.81,3.073; 9 2.54,3.073; 10 1.27,3.073; 11 0,3.073; 12 -1.27,3.073; 13 -2.54,3.073; 14 -3.81,3.073
LQFP-100 = smd 0.34 x 1.35: 1 -6,-7.85; 2 -5.5,-7.85; 3 -5,-7.85; 4 -4.5,-7.85; 5 -4,-7.85; 6 -3.5,-7.85; 7 -3,-7.85; 8 -2.5,-7.85; 9 -2,-7.85; 10 -1.5,-7.85; 11 -1,-7.85; 12 -0.5,-7.85; 13 0,-7.85; 14 0.5,-7.85; 15 1,-7.85; 16 1.5,-7.85; 17 2,-7.85; 18 2.5,-7.85; 19 3,-7.85; 20 3.5,-7.85; 21 4,-7.85; 22 4.5,-7.85; 23 5,-7.85; 24 5.5,-7.85; 25 6,-7.85; 51 6,7.85; 52 5.5,7.85; 53 5,7.85; 54 4.5,7.85; 55 4,7.85; 56 3.5,7.85; 57 3,7.85; 58 2.5,7.85; 59 2,7.85; 60 1.5,7.85; 61 1,7.85; 62 0.5,7.85; 63 0,7.85; 64 -0.5,7.85; 65 -1,7.85; 66 -1.5,7.85; 67 -2,7.85; 68 -2.5,7.85; 69 -3,7.85; 70 -3.5,7.85; 71 -4,7.85; 72 -4.5,7.85; 73 -5,7.85; 74 -5.5,7.85; 75 -6,7.85 | smd 1.35 x 0.34: 26 7.85,-6; 27 7.85,-5.5; 28 7.85,-5; 29 7.85,-4.5; 30 7.85,-4; 31 7.85,-3.5; 32 7.85,-3; 33 7.85,-2.5; 34 7.85,-2; 35 7.85,-1.5; 36 7.85,-1; 37 7.85,-0.5; 38 7.85,0; 39 7.85,0.5; 40 7.85,1; 41 7.85,1.5; 42 7.85,2; 43 7.85,2.5; 44 7.85,3; 45 7.85,3.5; 46 7.85,4; 47 7.85,4.5; 48 7.85,5; 49 7.85,5.5; 50 7.85,6; 76 -7.85,6; 77 -7.85,5.5; 78 -7.85,5; 79 -7.85,4.5; 80 -7.85,4; 81 -7.85,3.5; 82 -7.85,3; 83 -7.85,2.5; 84 -7.85,2; 85 -7.85,1.5; 86 -7.85,1; 87 -7.85,0.5; 88 -7.85,0; 89 -7.85,-0.5; 90 -7.85,-1; 91 -7.85,-1.5; 92 -7.85,-2; 93 -7.85,-2.5; 94 -7.85,-3; 95 -7.85,-3.5; 96 -7.85,-4; 97 -7.85,-4.5; 98 -7.85,-5; 99 -7.85,-5.5; 100 -7.85,-6
SOT23 = smd 1 x 1.4: 1 -0.95,-1.1; 2 0.95,-1.1; 3 0,1.1
X_3225 = smd 1.6 x 1.5: 1 -1.25,-1.15; 2 1.25,-1.15; 3 1.25,1.15; 4 -1.25,1.15
CHIP-LED0603 = smd 0.8 x 0.8: A -0.75,0; C 0.75,0
NRS4018 = smd 1.2 x 3.7: 1 -1.4,0; 2 1.4,0
R0603 = smd 0.95 x 0.95: 1 -0.725,0; 2 0.725,0
QFN50P400X400X100-25N = smd 0.813 x 0.305: 1 -1.981,1.245; 2 -1.981,0.762; 3 -1.981,0.254; 4 -1.981,-0.254; 5 -1.981,-0.762; 6 -1.981,-1.245; 13 1.981,-1.245; 14 1.981,-0.762; 15 1.981,-0.254; 16 1.981,0.254; 17 1.981,0.762; 18 1.981,1.245 | smd 0.305 x 0.813: 7 -1.245,-1.981; 8 -0.762,-1.981; 9 -0.254,-1.981; 10 0.254,-1.981; 11 0.762,-1.981; 12 1.245,-1.981; 19 1.245,1.981; 20 0.762,1.981; 21 0.254,1.981; 22 -0.254,1.981; 23 -0.762,1.981; 24 -1.245,1.981 | smd 2.591 x 2.591: 25 -0.025,0
SOIC8-N_MC = smd 1.981 x 0.559: 1 -2.362,1.905; 2 -2.362,0.635; 3 -2.362,-0.635; 4 -2.362,-1.905; 5 2.362,-1.905; 6 2.362,-0.635; 7 2.362,0.635; 8 2.362,1.905
OMAT_IC_2_SOT23-6 = smd 1.25 x 0.6: 1 -1.25,0.95; 2 -1.25,0; 3 -1.25,-0.95; 4 1.25,-0.95; 5 1.25,0; 6 1.25,0.95
OMAT_IC_2_R0603 = smd 0.95 x 0.95: 1 -0.725,0; 2 0.725,0
OMAT_IC_2_R1206 = smd 1.6 x 1.803: 1 -1.422,0; 2 1.422,0
PASSIIVIT_R0603 = smd 0.95 x 0.95: 1 -0.725,0; 2 0.725,0
OMAT_IC_2_SOT23 = smd 1 x 1.4: 1 -0.95,-1.1; 2 0.95,-1.1; 3 0,1.1
OMAT_IC_2_DO214AC = smd 1.8 x 1.7: A 2.05,0; C -2.05,0
DO214AC = smd 1.8 x 1.7: A 2.05,0; C -2.05,0
B4B-PH-K-S = drill 0.7 square: 1 -3,0.55 | drill 0.7: 2 -1,0.55; 3 1,0.55; 4 3,0.55
LIITTIMET_15110102601 = smd 0.8 x 1.1: A1 -2.54,2.765; A2 -1.27,2.765; A3 0,2.765; A4 1.27,2.765; A5 2.54,2.765; B1 -2.54,-2.74; B2 -1.27,-2.74; B3 0,-2.74; B4 1.27,-2.74; B5 2.54,-2.74 | smd 1.2 x 2.5: M1 -5.045,2.55; M2 -5.045,-2.55; M3 5.045,-2.55; M4 5.045,2.55 | hole 1.6: -4.738,-0.022; 4.738,-0.022
TE_RUUVILIITIN2 = drill 1.1 pad 2 square: 1 0,0 | drill 1.1 pad 2: 2 5.08,0
PIIKKIRIMA-3 = drill 1.016 square: 1 0,0 | drill 1.016: 2 2.54,0; 3 5.08,0
B6B-PH-K-S = drill 0.7 square: 1 -5,0.55 | drill 0.7: 2 -3,0.55; 3 -1,0.55; 4 1,0.55; 5 3,0.55; 6 5,0.55
B8B-PH-K-S = drill 0.7 square: 1 -7,0.55 | drill 0.7: 2 -5,0.55; 3 -3,0.55; 4 -1,0.55; 5 1,0.55; 6 3,0.55; 7 5,0.55; 8 7,0.55
629105136821 = smd 0.4 x 1.35: 1 -1.3,0; 2 -0.65,0; 3 0,0; 4 0.65,0; 5 1.3,0 | smd 1.8 x 1.9: Z1 -4,-2.675; Z4 4,-2.675 | smd 1.9 x 1.9: Z2 -1.15,-2.675; Z3 1.15,-2.675
EKE_PTH-3.2-6.5SQ = drill 3.2 pad 6.5 square: 1 0,0

### Placement (x,y rotation side)
C1  14.35,12.55 0 top
C2  11.5,13 180 top
C3  11.5,14.45 180 top
C4  14.55,14.25 0 top
C5  38.3,12.55 0 top
C6  35.45,13 180 top
C7  35.45,14.45 180 top
C8  38.5,14.25 0 top
C9  35.65,67.4 180 top
C10  38.5,67 0 top
C11  38.5,65.55 0 top
C12  35.45,65.75 180 top
C13  11.7,67.5 180 top
C14  14.55,67.1 0 top
C15  14.55,65.65 0 top
C16  11.5,65.85 180 top
C17  11.5,50.5 90 top
C18  27,45.5 0 top
C19  16.45,29.15 270 bottom
C20  14.95,29.15 270 bottom
C21  22,32.4 0 bottom
C26  21,46 0 bottom
C29  19.5,35.6 90 bottom
C30  9.1,50.45 90 bottom
C31  13,35.6 90 bottom
C32  15.25,28.9 180 top
C33  18.1,28.9 0 top
C34  30.45,35.5 180 bottom
C35  46.9,33.4 180 bottom
C36  46.9,30.4 180 bottom
C37  46.9,27.4 180 bottom
C38  38.05,46.7 270 top
C39  32.65,47.25 270 top
C40  33.65,55.35 180 top
C41  37.25,55.35 0 top
C42  27.95,14.7 270 top
C43  22.45,15.5 270 top
C44  27.15,23.6 0 top
C45  23.35,23.6 180 top
C46  44.2,56 0 bottom
C47  18.6,26.3 0 bottom
C48  44.15,60 0 bottom
C49  24.95,10.05 180 bottom
C54  23.15,23.2 0 bottom
C55  26,23.2 180 bottom
C58  15.45,35.6 90 bottom
C61  1.5,55 90 bottom
C62  4.7,55 90 bottom
D1  33,29.8 270 bottom
D2  16.5,40 0 top
D10  16.5,38.95 0 bottom
G1  16.65,25.95 0 top
H1  7.4,29 0 top
H2  7.4,23 0 top
H3  7.4,26 0 top
H4  7.4,20 0 top
L1  25.15,20.1 270 top
L2  13.45,29.15 270 bottom
L3  23.15,21.7 0 bottom
L4  35.45,51.85 270 top
L5  42.6,56 180 top
L7  6.5,53.25 270 top
N1  13,9 90 top
N2  37,9 90 top
N3  37,71 270 top
N4  13,71 270 top
N5  23.3,27.8 90 bottom
N6  35.35,47.15 270 top
N7  25.25,15.3 270 top
R1  9.3,10.05 270 top
R2  9.3,12.9 270 top
R3  7.8,6.7 90 top
R4  9.3,6.7 90 top
R5  10.5,9 270 bottom
R6  15.5,9 270 bottom
R7  33.3,10.05 270 top
R8  33.3,12.9 270 top
R9  31.85,6.7 90 top
R10  33.3,6.7 90 top
R11  34.5,9 270 bottom
R12  39.5,9 270 bottom
R13  40.7,69.9 90 top
R14  40.7,67.05 90 top
R15  42.15,73.25 270 top
R16  40.7,73.25 270 top
R17  39.5,71 90 bottom
R18  34.5,71 90 bottom
R19  16.7,69.9 90 top
R20  16.7,67.05 90 top
R21  18.15,73.3 270 top
R22  16.7,73.3 270 top
R23  15.5,71 90 bottom
R24  10.5,71 90 bottom
R25  17.45,35.6 270 bottom
R26  24.9,32.4 180 bottom
R27  6.15,33 180 top
R28  27.9,39.5 180 top
R29  7.85,55 270 bottom
R30  10.65,29 180 top
R31  10.7,23 180 top
R32  10.7,26 180 top
R33  25.75,64.9 270 bottom
R34  28.2,65.6 180 top
R35  25.75,64.9 270 top
R36  18.6,27.8 180 bottom
R37  28.2,68.3 180 bottom
R38  2.3,43.3 270 top
R39  6.35,55 270 bottom
R40  40.1,32 180 bottom
R41  40.1,29 180 bottom
R42  40.1,26 180 bottom
R43  36.35,44.15 0 top
R44  33.35,44.15 0 top
R45  26.35,12 0 top
R46  23.45,12 0 top
R47  42.7,54 180 top
R48  42.65,48 180 top
R49  30.25,37.8 180 bottom
R50  6.15,31.5 0 top
R51  13.8,43.95 180 bottom
R52  30.05,67.95 90 top
R53  10.35,52.75 180 top
R54  10.7,20 180 top
R85  19.25,24.05 90 bottom
R86  1.4,40.3 270 top
R87  22,28.1 90 top
R88  3,40.3 270 top
U$1  45.8,21.1 90 top
V1  28.05,64.5 180 bottom
V2  38,33.5 180 top
V3  38,30.4 180 top
V4  38,27.3 180 top
V5  24.95,7.55 180 bottom
V26  24.55,69.25 0 bottom
X1  13,2.5 0 top
X2  37,2.5 0 top
X3  37,77.5 180 top
X4  13,77.5 180 top
X5  25,75 0 top
X6  22.46,4 0 top
X7  43.1,32 0 top
X8  2.5,55 270 top
X9  43.1,29 0 top
X10  43.1,26 0 top
X11  47.5,53 90 top
X12  25,76 180 bottom
Y1  3.44,3.44 0 top
Y2  46.5,3.5 0 top
Y3  46.5,76.5 0 top
Y4  3.5,76.5 0 top

### Tracks (layer width: path | path; a pad name or v marks a point on that pad's centre or on a via)
+3V3  (via drill 0.3 pad 0.3, 0.35)
  Top 0.2: C45.1 C44.1 26.2,22.55 25.25,21.6 | 25.25,21.6 L1.1 | R45.2 28.81,12 29.18,12.37 29.18,21.06 28.64,21.6 25.25,21.6 | R52.2 30.05,69.75 v30,69.8 | X5.B3 25,71.41 v25.4,71.01 | R53.2 9.62,53.88 v9.6,53.9 | L7.2 v6.5,51.4 | H4.A v6.65,21.1 | R50.2 v8.2,31.5
  Top 0.23: v9.1,47.85 D2.75 | D2.6 v13,33.7 13,34.4 12.65,34.75 10.3,34.75 9.55,34 D2.100 | D2.11 v15.5,33.7 | D2.19 v19.5,33.7 20.8,35 D2.28 | D2.50 v22.8,46
  Top 1: C44.1 v26.2,25 | L1.1 21.5,21.5 v21.3,21.7
  Route2 0.2: v25.4,71.01 v25.4,71 | v6.5,51.4 6.3,51.4 | v13.45,27.2 13.25,27.2 | v6.65,21.1 6.6,21.1 | v30.98,38.9 27.9,38.9 | v13.7,44.93 13.7,45.1 | v27,63.4 27,63.3 | v8.2,31.5 8.2,31.55 8.25,31.55 8.25,31.5
  Route2 0.4: v14.4,40.05 14.4,40
  Route2 1: v26.2,25 26.1,25
  Bottom 0.2: L2.2 v13.45,27.2 | L3.2 v21.3,21.7 | R49.2 v30.98,38.9 | R51.2 14.53,44.8 14.43,44.9 13.73,44.9 v13.7,44.93 | V1.3 v27,63.4
  Bottom 0.23: C30.1 v9.1,47.85 | v13,33.7 C31.1 | v15.5,33.7 15.45,33.75 C58.1 | v19.5,33.7 C29.1 19.48,34.88 R25.2 | v22.8,46 C26.1
  Bottom 0.4: D10.3 v14.4,40.05
  pour Top (no thermals): 23.85,24.2 26.65,24.2 26.65,21.2 23.85,21.2
  pour Route2 (rank 3): 0,18 39,18 39,32 28.5,32 28.5,57 32,60.5 32,71 31,72 19,72 18,71 18,65 16.3,63.3 9.7,63.3 8,65 0,65
+5V  (via drill 0.3 pad 0.3)
  Top 0.2: R43.2 38.8,44.15 39.4,44.75 39.4,52.6 38.7,53.3 35.5,53.3 L4.1
  Top 0.5: v41.35,57.25 41.88,56.73 L5.2
  Top 1: C40.1 v34.6,56.9 | C41.1 v36.3,56.9
  Route2 1: v34.6,56.9 34.7,56.9 | v36.3,56.9 36.4,56.9
  Bottom 0.2: D1.14 29.73,33.81 | 29.73,34.47 v29.7,34.5
  Bottom 0.4: C34.1 v29.7,34.5 | 29.73,34.47 29.73,33.81
  pour Top (no thermals): 34.15,56 36.75,56 36.75,52.85 34.3,52.85 34.15,53
  pour Route2: 32,60 42,60 42,51.5 30.5,51.5 30.5,42.5 38,42.5 38.5,42 38.5,32.5 28.5,32.5 28.5,56.5
+VBAT  (via drill 0.3 pad 0.3, 0.35)
  Top 0.23: N7.3 24.3,15.55 24.7,15.15 24.95,15.15 25.25,14.85 N7.5 | N6.5 35.35,46.85 35.15,47.05 34.6,47.05 34.4,47.25 N6.3
  Top 1: v41,38 37,38 35.95,36.95 V2.A V3.A V4.A 35.95,23.05 37,22 v41,22 | C43.1 v20.97,16.45 | C4.1 v13.6,15.69 | C3.1 v12.25,15.7 | C8.1 v37.55,15.77 | C7.1 v36.2,15.76 | v31.9,49.9 31.9,48.95 C39.1 32.95,48.5 33,48.5 33,49.53 32.95,49.58 32.95,49.9 | C12.1 v36.4,64.2 | C11.1 v37.75,64.2 | C16.1 v12.45,64.1 | C15.1 v13.8,64.1
  Route2 0.23: v19.25,18.98 19.25,18.35 20.97,16.63 v20.97,16.45
  Route2 1: v13.6,15.69 13.6,15.64 13.57,15.64 | v12.25,15.7 12.13,15.7 12.13,15.69 | v37.55,15.77 v37.54,15.77 36.32,14.55 36.29,14.58 | v36.2,15.76 36.35,15.76 36.35,15.74 | v36.4,64.2 36.3,64.2 | v37.75,64.2 37.6,64.2 | v12.45,64.1 12.7,64.1 | 21.3,9.75 v21.3,9.95 v21.3,8.95 21.25,8.9 21.25,7.85 21.3,7.85 v21.3,7.55
  Bottom 0.23: R85.1 v19.25,18.98
  Bottom 1: X6.1 22.46,7.11 V5.C | V5.C 22.9,8.95 | 22.9,8.95 C49.1 23.9,9.95 v21.3,9.95 | 22.9,8.95 v21.3,8.95 | V5.C v21.3,7.55
  other vias: 33,49.9
  pour Top (no thermals): 12.65,10.65 12.65,13.75 11.8,13.75 11.8,15.1 14,15.1 14,12.15 13.35,12.15 13.35,10.65
  pour Top (no thermals): 36.65,10.65 36.65,13.75 35.8,13.75 35.8,15.15 37.95,15.15 37.95,12.15 37.35,12.15 37.35,10.65
  pour Top (no thermals): 37.35,69.2 37.35,66.25 38.2,66.25 38.2,64.8 36,64.8 36,67.8 36.65,67.8 36.65,69.2
  pour Top (no thermals): 13.35,69.35 13.35,66.35 14.25,66.35 14.25,64.9 12.05,64.9 12.05,67.85 12.65,67.85 12.65,69.35
  pour Top (no thermals): 24.55,17.2 21.85,17.2 21.85,16 24.55,16
  pour Top (no thermals): 32,48.95 34.6,48.95 34.6,47.8 32,47.8
  pour Route2 (rank 4): 0,80 50,80 50,0 0,0 0,7.3 0.1,7.4 2.7,7.4 2.7,12.4 0.2,12.4 0.1,12.39 0,18 39,18 39,42.5 38.5,43 31,43 31,51 42,51 42,60 32,60 32,71 31,72 19,72 18,71 18,65 16.3,63.3 9.7,63.3 8,65 0,65
  cutout Route2 (rank 6): 20.75,5.7 24.1,5.7 24.2,5.6 24.2,2.4 20.75,2.4
ATT  (via drill 0.35)
  Top 0.2: v18.2,30.75 18.66,30.75 19.5,29.91 19.5,28.91 21.03,27.38 R87.1
  Bottom 0.2: X8.5 2.15,52 1.4,51.25 1.4,34.9 1.85,34.45 6.31,34.45 6.89,33.87 7.88,33.87 9.7,32.05 16.9,32.05 v18.2,30.75
BOOT0
  Top 0.2: D2.94 7.4,37 7.1,36.7 7.1,36.3 5.42,34.62 R27.2
BOOT1
  Top 0.2: D2.37 R28.2
CLK
  Top 0.2: X8.6 3,49.95 3,44.63 3.03,44.6 3.03,41.99 3,41.97 R88.1
CMD
  Top 0.2: R86.1 1.4,57.4 2,58 X8.2
DATA
  Top 0.2: R38.1 2.3,44.9 2,45.2 2,56.6 2.54,57.14 3.4,57.14 3.91,57.65 3.91,58.35 3.05,59.21 X8.1
DIR_1  (via drill 0.35)
  Top 0.2: N1.9 15.99,8.75 18,10.76 18,15.4 16.14,17.25 4.64,17.25 2.45,19.44 2.45,32.05 3.23,32.83 v3.23,35.85 | v21.6,40.5 D2.39
  Bottom 0.2: v3.23,35.85 3.23,41.08 4.3,42.15 9.36,42.15 9.64,41.87 10.61,41.87 10.73,41.99 15.93,41.99 16.08,41.84 16.92,41.84 17.21,42.13 20.05,42.13 21.6,40.58 v21.6,40.5
DIR_2
  Top 0.2: N2.9 40.14,8.75 42.1,10.71 42.1,17.15 40.5,18.75 39.35,18.75 39.23,18.75 35.25,18.75 33.05,20.95 33.05,39.1 30.65,41.5 D2.41
DIR_3  (via drill 0.35)
  Top 0.23: v29.65,44.15 29.18,43.68 28.08,43.68 26.41,42 D2.42 | N3.9 33.57,71.25 31.81,69.49 31.81,64.26 31.05,63.5 v30.65,63.5
  Bottom 0.23: v30.65,63.5 30.65,45.15 v29.65,44.15
DIR_4  (via drill 0.35)
  Top 0.2: N4.9 10.1,71.25 8.35,69.5 8.35,59.1 15.1,52.35 15.43,52.35 15.86,51.92 v15.86,50.95 | v21,44.25 21,42.8 21.3,42.5 D2.43
  Bottom 0.2: v15.86,50.95 15.86,44.9 16.86,43.9 20.65,43.9 v21,44.25
ENA_1_N  (via drill 0.35)
  Top 0.2: N1.7 16,7.75 18.71,10.46 18.71,15.69 16.44,17.96 4.93,17.96 3.16,19.74 3.16,31.5 | v4.49,35.8 4.49,32.99 3.16,31.66 3.16,31.5 | v4.49,40.8 4.49,43.24 4.75,43.5 D2.81 | R50.1 3.16,31.5
  Bottom 0.2: v4.49,35.8 v4.49,40.8
ENA_2_N  (via drill 0.35)
  Top 0.2: N2.7 40.15,7.75 42.81,10.42 42.81,17.44 40.72,19.53 35.57,19.53 33.85,21.25 33.85,39.35 30.17,43.03 v28.35,43.03 | v11.65,43 10.74,43 10.61,43.13 10.09,43.13 9.96,43 D2.82
  Bottom 0.2: v28.35,43.03 27.83,43.55 16,43.55 15.45,43 v11.65,43 11.65,43.75 11.85,43.95 R51.1
ENA_3_N  (via drill 0.35)
  Top 0.2: N3.7 34.16,72.25 34.15,72.25 34.01,72.11 33.37,72.11 31.04,69.78 31.04,67.2 31.04,65.25
  Top 0.23: D2.83 v10.35,42.5 | 31.04,65.25 v30.75,64.96 v30.75,64.95 | R52.1 31.02,67.22 31.04,67.2
  Bottom 0.23: v10.35,42.5 10.99,42.5 11.13,42.35 16.08,42.35 16.23,42.2 16.77,42.2 17.06,42.5 20.2,42.5 21,41.7 26.52,41.7 26.73,41.48 28.09,41.48 29.2,42.6 29.2,43.69 29,43.88 29,44.42 30.27,45.68 30.27,62.97 30,63.23 30,63.77 30.57,64.33 30.57,64.8 30.72,64.95 v30.75,64.95
ENA_4_N  (via drill 0.35)
  Top 0.2: N4.7 10.99,72.22 10.07,72.22 7.6,69.74 7.6,58.85 13.03,53.42 | 13.03,53.42 14.6,51.85 v14.6,51 | v14.6,45.6 14.6,43.3 13.3,42 10.74,42 10.61,41.87 10.09,41.87 9.96,42 D2.84 | 13.03,53.42 12.35,52.75 R53.1
  Bottom 0.2: v14.6,51 v14.6,45.6
ENABLE_PWM_N  (via drill 0.35)
  Top 0.23: D2.85 10.6,41.5 11.1,41 v11.1,40.95
  Bottom 0.23: D1.1 37.34,33.61 37.55,33.4 37.55,31.9 37.35,31.7 34.35,31.7 34.05,31.4 34.05,30.2 | D1.4 34.45,29.8 34.05,30.2 | 34.05,30.2 33.7,30.2 32.03,28.53 D1.10 29.91,28.55 28.75,28.55 28.55,28.75 28.55,37.25 28.55,37.27 28.06,37.75 | v11.1,40.95 12.57,40.95 12.69,41.07 17.38,41.07 19.3,39.15 26.66,39.15 28.06,37.75 | R49.1 29.48,37.75 28.06,37.75
FAULT_N  (via drill 0.35)
  Top 0.2: N1.13 15.18,10.98 15.84,11.64 15.84,12.05 17.25,13.46 17.25,14.56 16.81,15 16.8,15 v16.5,15.3 16.5,15.4 15.35,16.55 4.35,16.55 1.12,19.78 1.12,36.21 2.29,37.38 4.11,37.38 4.24,37.25 v5.75,37.25 | D2.87 7.35,40.5 7.2,40.35 v5.75,40.35 v5.75,42.85 | N2.13 39.05,10.98 39.99,11.93 39.99,11.95 41.35,13.31 41.35,16.15 40.25,17.25 39.14,17.25 38.86,16.97 38.34,16.97 38.06,17.25 37.25,17.25 v37.05,17.05 | N4.13 10.6,69.02 10.11,68.52 10.11,67.72 9.15,66.76 9.15,59.9 v10.2,58.85 10.2,58.25 15.3,53.15 20.34,53.15 24.18,56.99 24.18,57.58 v24.2,57.6 | N3.13 34.6,69.02 34,68.42 34,67.5 v33.35,66.85
  Bottom 0.2: v5.75,37.25 v5.75,40.35 | v37.05,17.05 28.09,17.05 27.56,17.58 27.04,17.58 26.51,17.05 21.23,17.05 21.22,17.06 18.26,17.06 v16.5,15.3 | v5.75,42.85 6.83,43.93 6.83,45.26 6.82,45.27 6.82,48.17 7.9,49.25 7.9,52.4 8.99,53.49 8.99,54.15 10.2,55.36 v10.2,58.85 | v33.35,66.85 32.6,66.1 30.51,66.1 29.77,65.36 29.77,64.55 29.29,64.07 29.29,62.48 24.4,57.6 v24.2,57.6
GND  (via drill 0.3, 0.3 pad 0.3, 0.35)
  Top 0.2: C18.2 v28.8,45.5 | D2.99 v7.15,34.5 | N1.18 11.75,10.3 12.2,9.85 v12.2,9.8 | v36.2,9.8 35.76,10.24 N2.18 | D2.20 20,33.25 20.95,34.2 v22.7,34.2
  Top 0.23: D2.74 10.99,47.86 10.99,48.59 10.3,49.27 v10.3,49.3 | C17.2 v10.3,51.25
  Top 0.5: C40.2 v31.55,55.35 | C41.2 v39.25,55.35 | N6.1 36.85,48.4 v37.35,48.9 | v31.3,46.3 C39.2 32.65,45.27 v32.62,45.25 R44.1 | R46.1 v22.73,13.35 22.73,14.28 C43.2 | C45.2 v21.2,23.6 | C44.2 v29.3,23.6 | N7.1 26.9,16.55 v27.3,16.95
  Top 1: C4.2 v16.5,14.25
  Route15 0.2: v23.93,27.02 23.93,26.84
  Route15 0.5: v22.73,13.35 22.7,13.35 | v32.62,45.25 32.6,45.25 | v21.2,23.6 21.2,23.55
  Bottom 0.2: N5.2 v23.93,27.02 | C21.2 21.25,33.8 21.65,34.2 v22.7,34.2
  Bottom 0.23: C30.2 9.15,51.25 v10.3,51.25
  Bottom 0.3: 21.39,25.2 21.39,23.45 | C54.2 22.4,23.8 22.65,24.05 23.7,24.05 23.93,24.29 N5.2
  Bottom 0.5: C37.2 48.18,26.87 X10.3 | C36.2 48.18,29.87 X9.3 | C35.2 48.18,32.87 X7.3 | 21.39,25.2 N5.4 21.39,23.8 v21.2,23.6 21.6,23.2 C54.2 | v29.3,23.6 28.9,23.2 C55.2 | C61.2 1.75,56 X8.3 4.45,56 C62.2
  Bottom 1: X6.2 27.54,7.01 V5.A 27,8.95 C49.2
  other vias: 36.2,71.8 37.8,71.8 37.8,70.2 37,71 36.2,70.2 12.2,71.8 13.8,71.8 13,71 13.8,70.2 12.2,70.2 13.8,9.8 13.8,8.2 13,9 12.2,8.2 37.8,8.2 36.2,8.2 37,9 37.8,9.8 27.5,70.5 30,40 10.5,45.4 10.5,39.1 28.3,67.1 25.7,62.8 16.7,57.2 40.55,14.3 33.3,14.9 34.7,11.9 9.3,14.9 10.75,11.95 10.25,64.45 17.95,66.3 15.2,68.15 40.4,65.1 33.35,65.8 39.2,68.1 25.6,74.2 23.45,66.85 17.9,63.2 28.85,59.25 31.7,59.35 26.25,28.25 31.85,27.05 31.85,31.05 22.7,38.05 13,39.1 11.15,35.6 13.5,25.75 17.5,23.3 23.4,28.5 19.9,16.25 18,18.6 20.7,18.55 31.35,18.5 31.3,16.05 1.5,16.8 9.2,55.75 7.1,57 5.95,58.5 11.9,59.6 18.85,60.9 23.3,61.3 23.25,58.2 28.85,56.95 23.45,52.35 23.45,47.95 25.9,42.9 25.9,44.3 22.25,44.3 20.65,39.9 31.85,24.55 27.68,9.7 28.88,7.5 19.62,9.45 20.23,12.2 31.38,10.7 40.27,20.6 41.88,7.7 35.35,21.45 37.55,23.65 37.9,36.8 37.9,39.3 43.35,62.55 5.65,63.7 5.75,70.95 46.5,70.4 4.7,46.45 4.65,50.45 18.25,52.4 5.7,36.15 4.25,30.5
  pour Bottom: 9.58,11.23 16.38,11.23 16.4,11.21 16.4,6.78 9.58,6.78
  pour Bottom: 33.59,11.22 40.4,11.22 40.4,6.78 33.6,6.78 33.6,11.21
  pour Bottom: 9.6,73.2 16.4,73.2 16.4,68.8 16,68.8 9.6,68.8
  pour Bottom: 33.6,73.2 40.4,73.2 40.4,68.8 33.6,68.8
  pour Route15: 0,80 50,80 50,0 0,0 0,7.6 2.6,7.6 2.6,12.2 0,12.2
  pour Top (rank 2): 0,80 50,80 50,0 0,0
  pour Bottom (rank 2): 0,80 50,80 50,0 0,0 0,7.5 2.8,7.5 2.8,12.3 0,12.3
LED_DEBUG
  Top 0.2: D2.1 10.5,30.75 10.36,30.61 6.36,30.61 5.64,29.89 5.64,24.75 6.65,23.74 H2.A
LED_ERR
  Top 0.2: D2.3 11.5,30.4 10.95,29.85 7.15,29.85 6.65,29.35 H1.A
LED_RUN
  Top 0.2: D2.2 11,30.6 10.65,30.25 6.55,30.25 6,29.7 6,27.89 6.65,27.24 H3.A
LIDAR_VCC
  Top 0.5: L5.1 X11.6
  Bottom 0.5: X11.8 C48.1 44.9,56.05 C46.1 X11.6
MEASVBAT  (via drill 0.35)
  Top 0.2: v20.15,29.15 21.5,30.5 D2.23
  Bottom 0.2: R36.2 20.12,28.6 20.15,28.6 v20.15,29.15
  Bottom 0.3: R85.2 19.25,26.2 C47.1 19.35,27.77 R36.2
MODE_1  (via drill 0.35)
  Top 0.2: N1.10 16,9.25 17.65,10.9 17.65,15.25 16,16.9 4.5,16.9 1.47,19.93 1.47,34.62 v2.05,35.2 | v6.2,45 D2.78
  Bottom 0.2: v2.05,35.2 2.05,35.6 1.85,35.8 1.85,43.6 3.25,45 v6.2,45
MODE_2  (via drill 0.35)
  Top 0.2: N2.10 40.15,9.25 41.75,10.85 41.75,16.25 40.4,17.6 39,17.6 38.99,17.6 v38.6,17.6 | v5.3,44.37 5.43,44.5 5.81,44.5 5.94,44.37 6.46,44.37 6.59,44.5 D2.79 | v2.1,33 2.1,34.36 2.68,34.94 2.68,35.46 2.55,35.59 v2.55,36.75
  Bottom 0.2: v5.3,44.37 3.57,44.37 2.55,43.35 v2.55,36.75 | v2.1,33 2.1,29.9 3.5,28.5 3.5,19.4 3.67,19.23 10.86,19.23 12.49,17.6 26.56,17.6 26.89,17.93 27.71,17.93 28.04,17.6 36.71,17.6 36.79,17.68 37.31,17.68 37.39,17.6 v38.6,17.6
MODE_3  (via drill 0.35)
  Top 0.23: v13.96,49.9 14.36,50.3 18.56,50.3 32.19,63.94 32.19,69.33 33.61,70.75 N3.10 | v13.2,45.85 11.35,44 D2.80
  Bottom 0.23: v13.96,49.9 13.96,46.61 v13.2,45.85
MODE_4  (via drill 0.35)
  Top 0.2: N4.10 10.09,70.74 8.75,69.4 8.75,59.2 15.24,52.7 15.57,52.7 16.43,51.85 v16.49,51.85 | v17.15,44.53 17.15,41.55 13.5,37.9 13.5,34.09 13.63,33.96 13.63,33.44 13.5,33.31 D2.7
  Bottom 0.2: v16.49,51.85 16.49,45.05 17.01,44.53 v17.15,44.53
N$1
  Top 0.2: N1.14 13.76,11.64 13.91,11.79 14.85,11.79 15.1,12.04 C1.2
N$2
  Top 0.23: 0.4,12.2 0.4,7.6 2.6,7.6 2.6,12.2 0.4,12.2
N$3
  Top 0.2: R4.2 9.63,7.75 N1.24
N$4
  Top 0.2: N1.21 10.99,9.22 9.4,9.22 R1.2
N$5
  Top 0.2: 10.2,10.3 10.2,9.95 10.39,9.76 N1.20 | 10.2,10.3 10.2,10.55 9.97,10.78 R1.1 R2.2 | N1.19 10.26,10.24 10.2,10.3
N$6
  Top 0.2: R3.2 7.8,8.09 7.95,8.24 N1.23
N$7  (via drill 0.35)
  Top 0.3: N1.2 12.24,6.17 12.06,6 v12.06,5.5
  Bottom 0.3: v12.06,5.5 10.5,7.07 R5.2
N$8  (via drill 0.35)
  Top 0.3: v13.94,5.5 13.94,5.94 13.76,6.12 N1.5
  Bottom 0.3: v13.94,5.5 15.5,7.07 R6.2
N$9
  Top 0.3: X1.4 14.75,4.3 14.75,5.86 14.24,6.37 N1.6
N$10
  Top 0.3: X1.3 13.25,3.8 N1.4
N$11
  Top 0.3: X1.1 11.2,4.25 11.2,5.81 11.76,6.37 N1.1
N$12
  Top 0.3: X1.2 12.75,3.8 N1.3
N$13
  Top 0.2: N2.14 37.76,11.54 37.97,11.75 38.88,11.75 39.05,11.92 C5.2
N$17
  Top 0.2: H4.C R54.2
N$18
  Top 0.2: N2.21 33.37,9.25 R7.2
N$19
  Top 0.2: 34.15,10.25 34.15,9.95 34.34,9.76 N2.20 | 34.15,10.25 34.15,10.55 33.92,10.78 R7.1 R8.2 | N2.19 34.16,10.24 34.15,10.25
N$20
  Top 0.2: R10.2 33.63,7.75 N2.24
N$21
  Top 0.2: R9.2 31.85,8.04 32.05,8.24 N2.23
N$22  (via drill 0.35)
  Top 0.3: N2.2 36.24,6.32 36.06,6.15 v36.06,5.5
  Bottom 0.3: v36.06,5.5 34.5,7.07 R11.2
N$23  (via drill 0.35)
  Top 0.3: v37.94,5.5 37.94,6.14 37.76,6.32 N2.5
  Bottom 0.3: v37.94,5.5 39.5,7.07 R12.2
N$24
  Top 0.3: X2.4 38.75,4.3 38.75,6.01 38.24,6.52 N2.6
N$25
  Top 0.3: X2.3 37.25,3.8 N2.4
N$26
  Top 0.3: X2.1 35.35,4.4 35.35,6.11 35.76,6.52 N2.1
N$27
  Top 0.3: N2.3 36.75,3.8 X2.2
N$28
  Bottom 0.2: R40.1 39.38,31.2 39.24,31.07 D1.3
N$29
  Bottom 0.2: R41.1 39.38,27.8 38.84,27.26 D1.6
N$30
  Bottom 0.2: R42.1 37.77,26 37.19,26.57 34.95,26.57 34.38,26 D1.8
N$31
  Top 0.2: C9.2 34.9,68.1 35.1,68.3 36.05,68.3 36.24,68.49 N3.14
N$33
  Top 0.2: N3.21 40.58,70.75 R13.2
N$34
  Top 0.2: N3.20 39.66,70.24 39.85,70.05 39.85,69.75 | 39.85,69.75 39.85,69.45 40.12,69.17 R13.1 R14.2 | N3.19 39.84,69.75 39.85,69.75
N$35
  Top 0.2: R16.2 40.42,72.25 N3.24
N$36
  Top 0.2: R15.2 42.15,71.91 42,71.76 N3.23
N$37  (via drill 0.35)
  Top 0.3: N3.2 37.76,73.98 37.94,74.15 v37.94,74.65
  Bottom 0.3: v37.94,74.65 39.5,73.08 R17.2
N$38  (via drill 0.35)
  Top 0.3: v36.06,74.65 36.06,74.1 36.24,73.93 N3.5
  Bottom 0.3: v36.06,74.65 34.5,73.08 R18.2
N$39
  Top 0.3: X3.4 35.25,75.7 35.25,74.24 35.76,73.73 N3.6
N$40
  Top 0.3: X3.3 36.75,76.2 N3.4
N$41
  Top 0.3: N3.1 38.24,73.82 38.62,74.19 38.62,75.56 X3.1
N$42
  Top 0.3: X3.2 37.25,76.2 N3.3
N$43
  Top 0.23: C38.1 35.55,47.45 35.35,47.65 N6.2
  pour Top (no thermals): 35.1,47.8 35.1,49.15 34.65,49.6 34.65,50.6 36.1,50.6 36.15,50.65 36.15,49.7 35.6,49.15 35.6,47.8
N$44
  Top 0.5: V4.C 44.34,27.3 X10.2
  Bottom 0.5: C37.1 45.64,26.89 X10.2
N$45
  Top 0.5: V3.C 44.24,30.4 X9.2
  Bottom 0.5: C36.1 45.64,29.89 X9.2
N$46
  Top 0.2: C13.2 10.95,68.1 11.15,68.3 12.1,68.3 12.24,68.44 N4.14
N$48
  Top 0.2: N4.21 16.58,70.75 R19.2
N$49
  Top 0.2: 15.85,69.75 15.85,70.05 15.66,70.24 N4.20 | 15.85,69.75 15.85,69.45 16.12,69.17 R19.1 R20.2 | N4.19 15.85,69.75
N$50
  Top 0.2: R22.2 16.37,72.25 N4.24
N$51
  Top 0.2: R21.2 18.15,71.95 17.96,71.76 N4.23
N$52  (via drill 0.35)
  Top 0.3: N4.2 13.76,73.78 13.94,73.95 v13.94,74.5
  Bottom 0.3: v13.94,74.5 15.5,72.94 R23.2
N$53  (via drill 0.35)
  Top 0.3: v12.07,74.5 12.07,73.9 12.24,73.73 N4.5
  Bottom 0.3: v12.07,74.5 10.5,72.93 R24.2
N$54
  Top 0.3: X4.4 11.15,75.8 11.15,74.09 11.76,73.48 N4.6
N$55
  Top 0.3: X4.3 12.75,76.2 N4.4
N$56
  Top 0.3: X4.1 14.65,75.6 14.65,73.99 14.24,73.58 N4.1
N$57
  Top 0.3: N4.3 13.25,76.2 X4.2
N$58
  Top 0.5: V2.C 44.14,33.5 X7.2
  Bottom 0.5: C35.1 45.64,32.89 X7.2
N$59
  Top 0.23: C38.2 38,45.9 N6.6
N$60
  Top 0.23: N6.4 34.4,44.48 R44.2 R43.1
N$61
  Bottom 0.3: R26.1 C21.1
N$64
  Top 0.2: H2.C R31.2
N$65
  Top 0.2: H1.C R30.2
N$66
  Top 0.2: H3.C R32.2
N$67  (via drill 0.3)
  Top 0.2: v25.75,66.8 R35.1 27.45,65.62 R34.2
  Bottom 0.2: V1.1 27.07,65.62 R35.1 v25.75,66.8
N$68
  Bottom 0.2: R37.2 29,68.22 V1.2
N$69
  Top 0.3: X11.7 47.93,58 48.5,57.45 48.5,52.55 47.95,52 X11.4
N$71
  Top 0.5: R48.1 X11.2
N$72
  Top 0.5: X11.5 R47.1
N$74
  Top 0.23: C42.1 25.45,15.45 25.25,15.65 N7.2
  pour Top (no thermals): 25.05,16 25.05,17.6 24.65,18 24.45,18 24.45,19 26.05,19 26.05,18 25.85,18 25.45,17.6 25.45,16
N$75
  Top 0.23: N7.6 27.85,14.05 C42.2
N$76
  Top 0.23: N7.4 24.3,12.12 R46.2 R45.1
OSCIN
  Top 0.2: D2.12 C32.1 16,28.41 16.45,27.95 16.45,25.85 G1.1
OSCOUT
  Top 0.2: D2.13 16.5,30.35 17.35,29.5 C33.1 17.35,28.3 17.55,28.1 17.55,27.45 G1.3
PSVCC
  Top 0.5: L7.1 3.08,53.98 X8.4
  Bottom 0.5: C61.1 1.75,54 X8.4 4.45,54 C62.1
PULSE_1  (via drill 0.35)
  Top 0.2: N1.8 15.98,8.24 18.36,10.61 18.36,15.54 16.29,17.61 4.79,17.61 2.81,19.59 2.81,31.86 3.86,32.91 v3.86,35.15 | v18.45,41.25 18.45,47.8 D2.59
  Bottom 0.2: v3.86,35.15 3.86,41.16 4.35,41.65 9.31,41.65 9.44,41.52 10.76,41.52 10.88,41.63 15.78,41.63 15.93,41.48 17.57,41.48 17.8,41.25 v18.45,41.25
PULSE_2  (via drill 0.35)
  Top 0.2: N2.8 40.13,8.24 42.45,10.56 42.45,17.29 40.6,19.15 35.4,19.15 33.45,21.1 33.45,39.2 30.8,41.85 27.78,41.85 v27.5,42.13 | v16.5,42.85 D2.63
  Bottom 0.2: v16.5,42.85 16.89,42.85 16.91,42.87 20.35,42.87 21.09,42.13 v27.5,42.13
PULSE_3  (via drill 0.35)
  Top 0.23: v19.08,45.05 19.18,44.95 19.18,40.87 18.67,40.35 16.6,40.35 14.15,37.9 14.15,33.81 v14.26,33.7 | v12,33.75 D2.4 | N3.8 34.18,71.76 34.17,71.75 33.52,71.75 31.43,69.65 31.43,64.61 30.96,64.15 30.38,64.15 30,63.77 30,62.29 18.81,51.1 v17.15,51.1
  Bottom 0.23: v17.15,51.1 17.15,45.75 17.85,45.05 v19.08,45.05 | v14.26,33.7 13.62,33.05 12.73,33.05 12.04,33.75 v12,33.75
PULSE_4  (via drill 0.35)
  Top 0.2: N4.8 10.11,71.76 7.95,69.59 7.95,59 15.23,51.72 v15.23,51.66 | v15.23,44.95 15.23,42.68 12,39.45 12,37.25 11.25,36.5 D2.95
  Bottom 0.2: v15.23,51.66 v15.23,44.95
RESETL  (via drill 0.35)
  Top 0.2: X5.A1 22.46,76.31 21.66,75.51 21.66,74.4 20.81,73.54 20.81,71.09 20.35,70.64 20.35,69.9 19.72,69.27 19.72,66.94 19.85,66.81 v19.85,54.35 | v19.15,46.15 19.8,45.5 19.8,38.25 19.4,37.85 v18.75,37.85
  Top 0.23: D2.14 v17,33.65
  Bottom 0.2: v19.85,54.35 19.85,50.34 19.77,50.26 19.77,48.32 19.15,47.7 v19.15,46.15 | v18.75,37.85 D10.1
  Bottom 0.23: v17,33.65 16.45,34.2 16.45,36 16.77,36.33 R25.1 D10.1
SERVO_1
  Bottom 0.2: R40.2 X7.1
SERVO_2
  Bottom 0.2: R41.2 X9.1
SERVO_3
  Bottom 0.2: R42.2 X10.1
SERVO_PWM_1  (via drill 0.35)
  Top 0.23: D2.31 27.49,36.5 27.63,36.35 28.17,36.35 28.31,36.5 v32.2,36.5
  Bottom 0.23: v32.2,36.5 32.2,32.85 32.71,32.34 D1.2
SERVO_PWM_2  (via drill 0.35)
  Top 0.23: v27.9,37 D2.32
  Bottom 0.23: D1.5 32.58,28.53 31.98,27.93 28.52,27.93 27.9,28.55 v27.9,37
SERVO_PWM_3  (via drill 0.35)
  Top 0.23: D2.35 v26.3,38.5
  Bottom 0.23: v26.3,38.5 27.2,37.6 27.2,28.45 28.39,27.26 D1.9
SLEEP_N  (via drill 0.35)
  Top 0.2: N1.22 10.03,8.75 9.88,8.6 8.72,8.6 7,10.32 v7,15.2 6.1,16.1 4.2,16.1 0.77,19.54 0.77,36.35 2.31,37.9 6.8,37.9 v6.8,37.87 | N2.22 34.03,8.75 33.88,8.6 32.72,8.6 32.57,8.75 31.65,8.75 29.72,10.68 20.22,10.68 19.06,11.84 19.06,15.83 16.33,18.56 10.54,18.56 v10.5,18.6 | N4.22 16.02,71.25 16.12,71.35 17.28,71.35 17.38,71.25 18.05,71.25 18.9,70.4 v18.9,69.3 | N3.22 40.02,71.25 40.12,71.35 41.28,71.35 41.38,71.25 42,71.25 42.55,70.7 42.55,63.85 41.8,63.1 34.25,63.1 v33.35,64 | D2.86 v6.8,41 v6.8,42.87 | v11.45,58.25 11.45,57.6 15.5,53.55 20.04,53.55 23.25,56.76 v23.25,57.05
  Bottom 0.2: v6.8,37.87 v6.8,41 | v18.9,69.3 20.7,69.3 20.72,69.28 20.96,69.28 21.33,68.91 21.33,65.64 19.65,63.95 16.7,63.95 14.55,61.8 12.65,61.8 10.83,59.98 10.83,58.25 | v10.5,18.6 8,18.6 7,17.6 v7,15.2 | v6.8,42.87 6.8,43.4 7.18,43.78 7.18,45.09 8.26,46.16 8.26,52.06 9.49,53.29 9.85,53.29 10.83,54.27 10.83,58.25 | 10.83,58.25 v11.45,58.25 | v23.25,57.05 23.86,57.05 23.94,56.97 24.72,56.97 29.9,62.15 29.9,62.82 29.64,63.08 29.64,63.92 30.12,64.4 30.12,65.21 30.49,65.58 31.01,65.58 31.44,65.15 32.75,65.15 33.35,64.55 v33.35,64
SPI1CLK
  Top 0.2: D2.89 3.08,39.5 R88.2
SPI1MISO
  Top 0.2: R38.2 2.3,41.63 2.27,41.6 2.27,38.99 2.42,38.85 3.58,38.85 3.73,39 D2.90
SPI1MOSI
  Top 0.2: D2.91 3.73,38.5 3.73,38.49 1.5,38.49 1.4,38.6 R86.2
SPI_CS_PS2_N
  Top 0.2: R87.2 D2.24
SWCLK  (via drill 0.35)
  Top 0.2: X5.A3 25,76.24 21.7,72.94 21.7,68.55 v20.35,67.2
  Bottom 0.2: R39.1 6.35,57.5 11.9,63.05 14.1,63.05 16.25,65.2 19.05,65.2 20.35,66.5 v20.35,67.2
SWCLK_CPU  (via drill 0.3 pad 0.3)
  Top 0.2: D2.76 7.3,46 6.3,47 v6.3,49.4
  Bottom 0.2: R39.2 6.29,54.21 6.3,54.2 6.3,52.06 5.89,51.65 5.89,51.15 6.3,50.74 v6.3,49.4
SWDIO  (via drill 0.35)
  Top 0.2: X5.A2 23.73,75.97 21.16,73.4 21.16,70.95 20.7,70.49 v20.7,68.65
  Bottom 0.2: R29.1 7.85,57.5 12.5,62.15 14.4,62.15 16.55,64.3 19.5,64.3 20.98,65.78 20.98,67.46 20.7,67.74 v20.7,68.65
SWDIO_CPU  (via drill 0.3 pad 0.3)
  Top 0.2: D2.72 12,46.75 11.8,46.55 7.85,46.55 7.3,47.1 7.3,50.3 v7.25,50.35
  Bottom 0.2: R29.2 7.85,53.3 7.25,52.7 v7.25,50.35
USART1RX
  Top 0.2: R47.2 41.1,54 40.8,54.3 40.8,56.3
  Top 0.23: D2.69 13.56,47.91 13.56,48.68 14.06,49.17 18.02,49.17 27.1,58.25 38.85,58.25 40.8,56.3
USART1TX
  Top 0.23: D2.68 14.06,47.91 14.06,48.64 14.22,48.79 18.24,48.79 27.32,57.87 38.69,57.87 40.42,56.14 40.42,48.73 41.15,48 R48.2
USART3RX  (via drill 0.35)
  Top 0.2: X5.A4 26.27,74.98 28.45,72.8 28.45,69.9 27.35,68.8 23.4,68.8 20.8,66.2 v20.8,55.2
  Top 0.23: v20.4,50 20,49.6 D2.56
  Bottom 0.23: v20.8,55.2 20.8,50.4 20.66,50.27 20.66,50.26 v20.4,50
USART3TX  (via drill 0.35)
  Top 0.2: X5.A5 27.54,74.47 29,73.01 29,69.7 27.75,68.45 23.6,68.45 21.7,66.55 v21.7,56.15
  Top 0.23: v21.31,50 21.05,49.74 21.05,49.73 20.5,49.19 D2.55
  Bottom 0.23: v21.7,56.15 21.7,50.39 v21.31,50
USB_DM  (via drill 0.35)
  Top 0.23: v13.05,49.7 13.05,47.9 D2.70
  Bottom 0.23: 24.3,75.95 24.3,68.35 | V26.4 23.35,68.35 24.3,68.35 | 24.3,68.35 24.3,66.15 20.44,62.29 17.35,62.29 12.72,57.66 12.72,50.03 v13.05,49.7
  Bottom 0.3: X12.2 24.3,75.95
USB_DP  (via drill 0.35)
  Top 0.23: v13.36,50.6 13.03,50.6 12.4,49.97 12.4,49.43 12.5,49.34 D2.71
  Bottom 0.23: X12.3 25,75.1 24.68,74.78 24.68,68.31 24.69,68.3 | 24.69,68.3 V26.3 R37.1 | 24.69,68.3 24.68,68.29 24.68,65.98 20.6,61.9 17.5,61.9 13.1,57.5 13.1,50.86 v13.36,50.6
USBRENUM  (via drill 0.35)
  Top 0.23: D2.54 21,49.1 21.25,49.35 21.58,49.35 22.4,50.18 v22.4,51.35
  Bottom 0.23: v22.4,51.35 22.4,61.9 24.68,64.17 R33.2
VCAP1
  Top 0.3: D2.49 C18.1
VCAP2
  Top 0.3: D2.73 C17.1
VDDA  (via drill 0.35)
  Top 0.3: D2.22 21,30.75 20.45,30.2 v20.1,30.2
  Bottom 0.3: v20.1,30.2 19.8,29.9 C19.1 C20.1 13.47,29.9 L2.1
VDDAREF
  Bottom 0.2: N5.3 22.66,27.16 23.2,27.7 24.6,27.7 25.2,27.09 N5.1
  Bottom 0.3: N5.1 25.25,25.39 C55.1 C54.1 23.9,21.73 L3.1
VINT_1  (via drill 0.3)
  Top 0.2: N1.17 v12.24,12 12.25,12.01 C2.1 | 16.05,10.25 16.05,9.95 15.86,9.76 N1.11 | v16.45,11.8 16.45,10.65 16.05,10.25 | N1.12 16.05,10.24 16.05,10.25
  Bottom 0.2: v12.24,12 13.55,12 13.75,11.8 v16.45,11.8
VINT_2  (via drill 0.3)
  Top 0.2: C6.1 v36.2,11.9 36.2,11.02 N2.17 | v40.6,11.7 40.6,10.75 40.1,10.25 | 40.1,10.25 40.1,9.95 39.9,9.75 38.99,9.75 N2.11 | N2.12 40.09,10.24 40.1,10.25
  Bottom 0.2: v36.2,11.9 37.35,11.9 37.55,11.7 v40.6,11.7
VINT_3  (via drill 0.3)
  Top 0.2: N3.17 37.76,68.1 | 37.76,68.1 37.76,67.01 C10.1 | 37.76,68.1 v37.75,68.09 | v33.35,68.27 33.35,69.15 33.9,69.7 | 33.9,69.7 33.9,70.05 34.1,70.25 35.01,70.25 N3.11 | N3.12 33.95,69.75 33.9,69.7
  Bottom 0.2: v37.75,68.09 37.15,68.09 36.95,68.29 33.35,68.29 v33.35,68.27
VINT_4  (via drill 0.3)
  Top 0.2: N4.17 13.8,68.98 13.8,68.07 | 13.8,68.07 C14.1 | 13.8,68.07 v13.77,68.07 | v9.5,68.27 9.5,69.5 9.7,69.7 9.85,69.7 | 9.85,69.7 9.85,70 10.1,70.25 11.01,70.25 N4.11 | N4.12 10.96,69.7 9.85,69.7
  Bottom 0.2: v13.77,68.07 11.8,68.07 11.6,68.27 v9.5,68.27
VREF25  (via drill 0.35)
  Top 0.2: D2.21 20.5,33.25 20.8,33.55 v25.6,33.55
  Bottom 0.2: v25.6,33.55 25.62,33.52 R26.2
  Bottom 0.3: N5.7 N5.8 25.2,31.36 25.62,31.77 R26.2
VUSB  (via drill 0.35)
  Top 0.23: R35.2 24.27,64.17 v22.75,65.7
  Bottom 0.23: 22.5,69.25 22.15,68.9 22.15,66.25 22.7,65.7 v22.75,65.7
  Bottom 0.3: X12.1 23.7,71.6 23.2,71.1 22.65,71.1 22.2,70.65 22.2,69.55 22.5,69.25 V26.5

### Text on the board
Top: 1
Route2: 2
Route15: 3
Bottom: 4
tPlace: SIG / VCC / GND | ERR | RUN | DBG | PWR | 2019 | LIPPA | KIMMOLI | + | -